# EAGLE schematic BM8L (EAGLE 6.6.0)

## Sheet 1 of 8
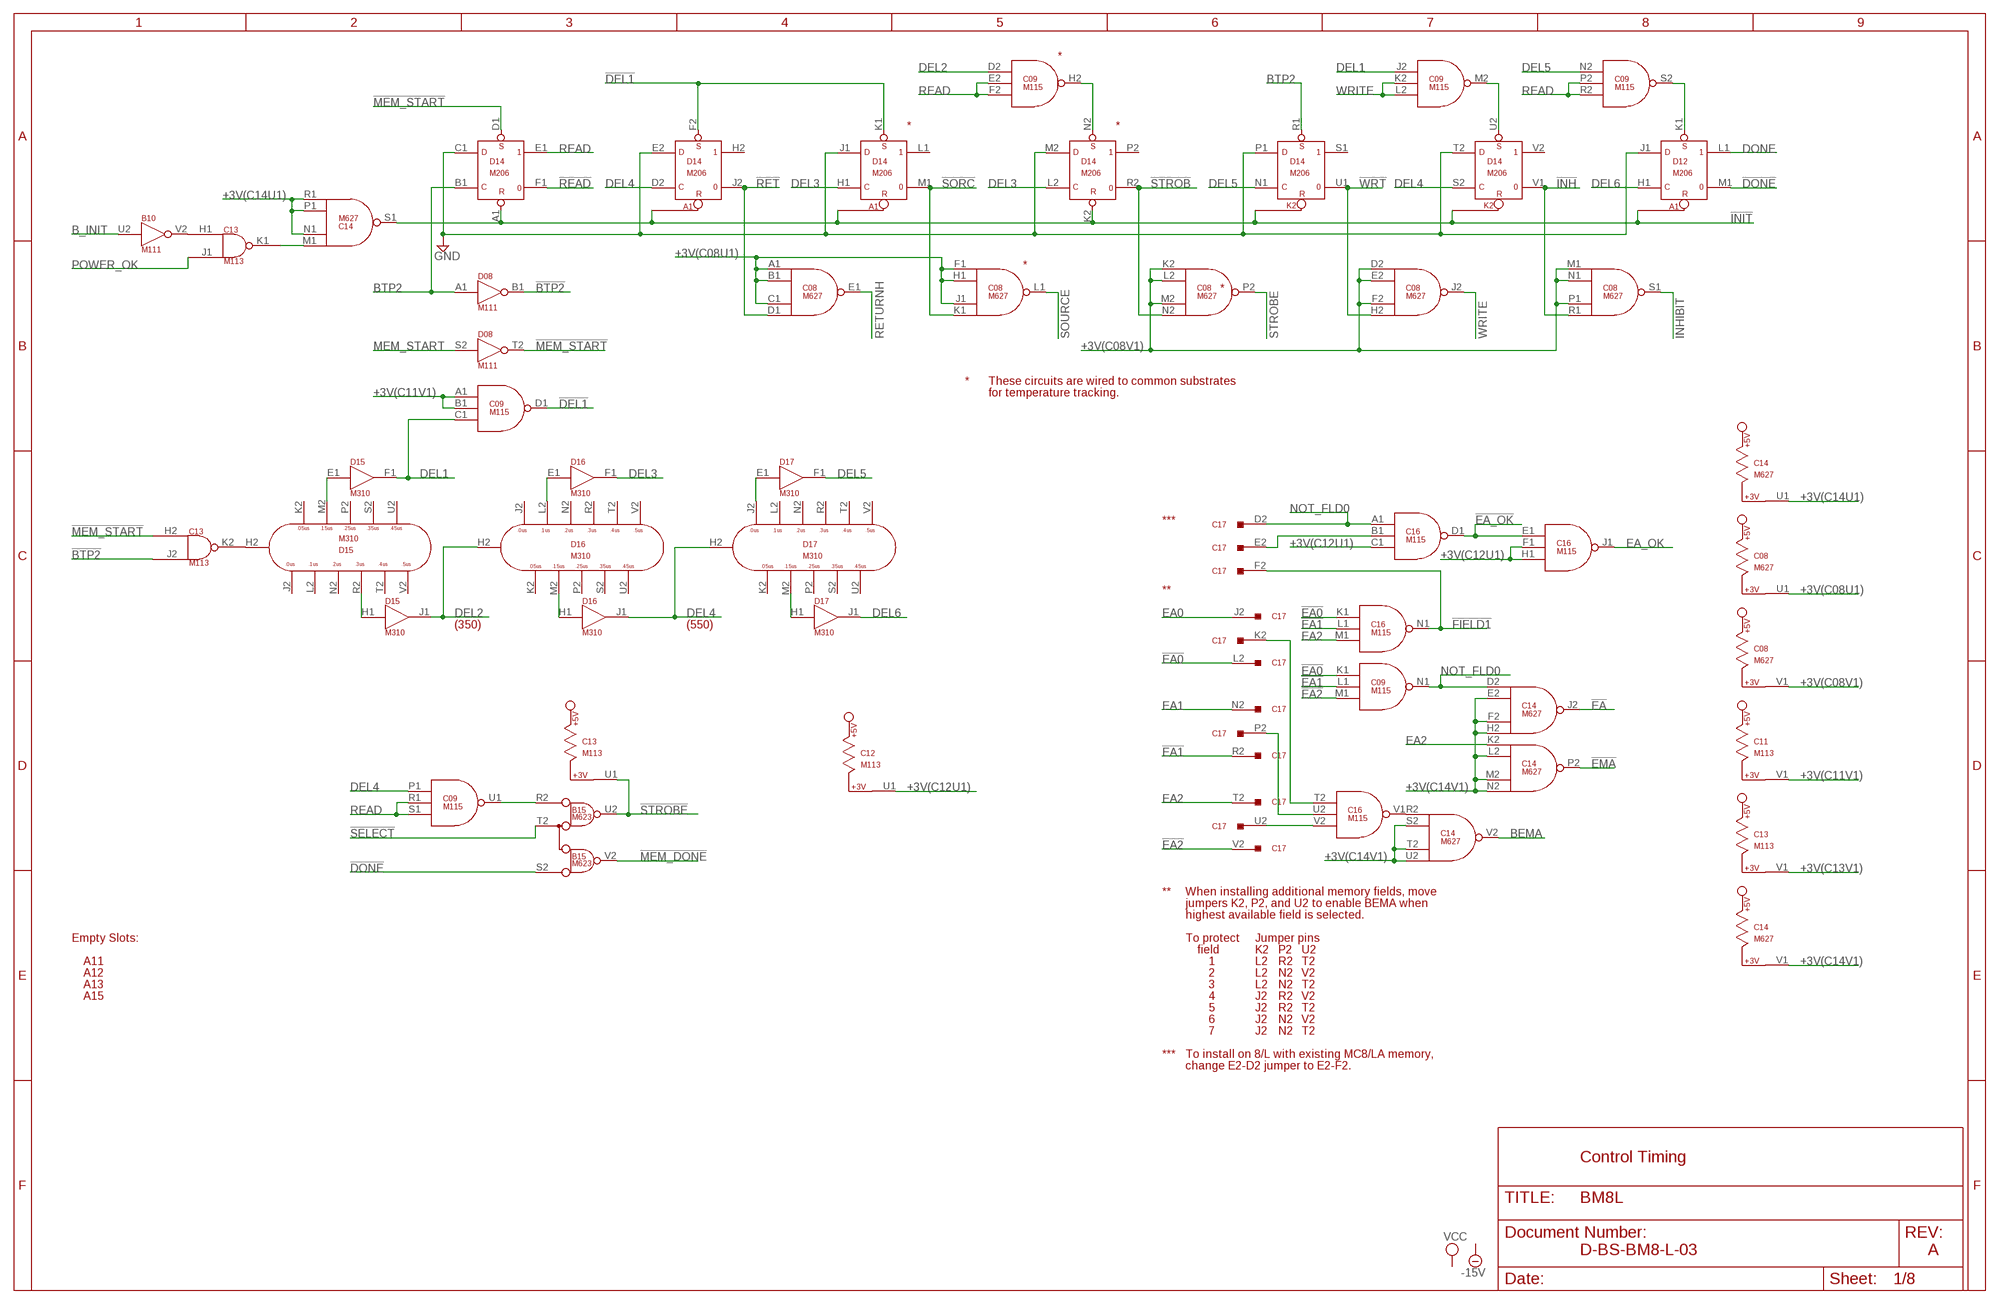
[diagram p0: schematic, sheet 1]

### Parts
A11  EMPTY  [H807]
A12  EMPTY  [H807]
A13  EMPTY  [H807]
A15  EMPTY  [H807]
B10  M111  [H807]
B15  M623  [H807]
C08  M627  [H807]
C09  M115  [H807]
C11  M113  [H807]
C12  M113  [H807]
C13  M113  [H807]
C14  M627  [H807]
C16  M115  [H807]
C17  M990  W023  [H807]
D08  M111  [H807]
D12  M206  M206X  [H807]
D14  M206  M206X  [H807]
D15  M310  [H807]
D16  M310  [H807]
D17  M310  [H807]

### Nets
!BTP2: C13.J2(K2:IN2) D08.B1(B1:OUT)
!DEL1: C09.D1(D1:OUT) D14.F2(H2:S) D14.K1(L1:S)
!DONE: B15.S2(U2:B) D12.M1
!EA: C14.J2(J2:OUT) ; also sheet 7
!EA0: C09.K1(N1:IN1) C16.K1(N1:IN1) C17.L2 ; also sheet 3
!EA1: C09.L1(N1:IN2) C16.L1(N1:IN2) C17.R2 ; also sheet 3
!EA2: C09.M1(N1:IN3) C17.V2 ; also sheet 3
!EA_OK: C16.D1(D1:OUT) C16.E1(J1:IN1)
!EMA: C14.P2(P2:OUT) ; also sheet 7
!FIELD1: C16.N1(N1:OUT) C17.F2 ; also sheet 3
!INH: C08.R1(S1:IN4) D14.V1
!INIT: C14.S1(S1:OUT) D14.A1(E1:R) D14.K2(P2:R) ; also sheet 3
!MEM_DONE: B15.V2(U2:E) ; also sheet 7
!MEM_START: C13.H2(K2:IN1) D08.T2(T2:OUT) D14.D1(E1:S)
!READ: D14.F1 ; also sheet 6
!RET: C08.D1(E1:IN4) D14.J2
!SELECT: B15.T2(U2:C) ; also sheet 3
!SORC: C08.K1(L1:IN4) D14.M1
!STROB: C08.N2(P2:IN4) D14.R2
!STROBE: B15.U2(U2:D) C13.U1 ; also sheet 7
!WRT: C08.H2(J2:IN4) D14.U1
+3V(C08U1): C08.A1(E1:IN1) C08.B1(E1:IN2) C08.C1(E1:IN3) C08.F1(L1:IN1) C08.H1(L1:IN2) C08.J1(L1:IN3) C08.U1 ; also sheet 3
+3V(C08V1): C08.D2(J2:IN1) C08.E2(J2:IN2) C08.F2(J2:IN3) C08.K2(P2:IN1) C08.L2(P2:IN2) C08.M1(S1:IN1) C08.M2(P2:IN3) C08.N1(S1:IN2) C08.P1(S1:IN3) C08.V1
+3V(C11V1): C09.A1(D1:IN1) C09.B1(D1:IN2) C11.V1 ; also sheet 3
+3V(C12U1): C12.U1 C16.C1(D1:IN3) C16.F1(J1:IN2) C16.H1(J1:IN3)
+3V(C13V1): C13.V1 ; also sheet 3
+3V(C14U1): C14.N1(S1:IN2) C14.P1(S1:IN3) C14.R1(S1:IN4) C14.U1 ; also sheet 4
+3V(C14V1): C14.E2(J2:IN2) C14.F2(J2:IN3) C14.H2(J2:IN4) C14.L2(P2:IN2) C14.M2(P2:IN3) C14.N2(P2:IN4) C14.S2(V2:IN2) C14.T2(V2:IN3) C14.U2(V2:IN4) C14.V1
B_INIT: B10.U2(V2:IN) ; also sheet 4,8
BEMA: C14.V2(V2:OUT) ; also sheet 7
BTP2: D08.A1(B1:IN) D14.B1(E1:C) D14.R1(S1:S) ; also sheet 7
DEL1: C09.C1(D1:IN3) C09.J2(M2:IN1) D15.F1(F1:OUT)
DEL2: C09.D2(H2:IN1) D15.J1(J1:OUT) D16.H2(H2:H2) ; also sheet 3
DEL3: D14.H1(L1:C) D14.L2(P2:C) D16.F1(F1:OUT) ; also sheet 3
DEL4: C09.P1(U1:IN1) D14.D2(H2:C) D14.S2(V2:C) D16.J1(J1:OUT) D17.H2(H2:H2) ; also sheet 3
DEL5: C09.N2(S2:IN1) D14.N1(S1:C) D17.F1(F1:OUT)
DEL6: D12.H1(L1:C) D17.J1(J1:OUT)
DONE: D12.L1 ; also sheet 6
EA0: C17.J2 ; also sheet 3,5,6
EA1: C17.N2 ; also sheet 3,5,6
EA2: C14.K2(P2:IN1) C16.M1(N1:IN3) C17.T2 ; also sheet 3
EA_OK: C16.J1(J1:OUT) ; also sheet 3
GND: D12.J1(L1:D) D14.C1(E1:D) D14.E2(H2:D) D14.J1(L1:D) D14.M2(P2:D) D14.P1(S1:D) D14.T2(V2:D) ; also sheet 2,3,5,6
INHIBIT: C08.S1(S1:OUT) ; also sheet 6
MEM_START: D08.S2(T2:IN) ; also sheet 3,7
N$1: B10.V2(V2:OUT) C13.H1(K1:IN1)
N$2: C13.K1(K1:OUT) C14.M1(S1:IN1)
N$3: B15.R2(U2:A) C09.U1(U1:OUT)
N$5: C09.M2(M2:OUT) D14.U2(V2:S)
N$6: C13.K2(K2:OUT) D15.H2(H2:H2)
N$7: D15.H1(J1:IN) D15.R2(H2:R2)
N$8: D15.E1(F1:IN) D15.M2(H2:M2)
N$9: D16.E1(F1:IN) D16.L2(H2:L2)
N$10: D16.H1(J1:IN) D16.M2(H2:M2)
N$11: D17.E1(F1:IN) D17.J2(H2:J2)
N$12: D17.H1(J1:IN) D17.M2(H2:M2)
N$13: C16.V2(V1:IN3) C17.U2
N$14: C16.U2(V1:IN2) C17.P2
N$15: C16.T2(V1:IN1) C17.K2
N$16: C14.R2(V2:IN1) C16.V1(V1:OUT)
N$17: C16.B1(D1:IN2) C17.E2
N$18: C09.H2(H2:OUT) D14.N2(P2:S)
N$19: C09.S2(S2:OUT) D12.K1(L1:S)
NOT_FLD0: C09.N1(N1:OUT) C14.D2(J2:IN1) C16.A1(D1:IN1) C17.D2
POWER_OK: C13.J1(K1:IN2) ; also sheet 7
READ: C09.E2(H2:IN2) C09.F2(H2:IN3) C09.P2(S2:IN2) C09.R1(U1:IN2) C09.R2(S2:IN3) C09.S1(U1:IN3) D14.E1 ; also sheet 3
RETURNH: C08.E1(E1:OUT) ; also sheet 6
SOURCE: C08.L1(L1:OUT) ; also sheet 6
STROBE: C08.P2(P2:OUT) ; also sheet 6
WRITE: C08.J2(J2:OUT) C09.K2(M2:IN2) C09.L2(M2:IN3) ; also sheet 3,4,6
Unconnected: B15.A1(D1:A) B15.B1(D1:B) B15.C1(D1:C) B15.D1(D1:D) B15.D2(H2:A) B15.E1(D1:E) B15.E2(H2:B) B15.F1(K1:A) B15.F2(H2:C) B15.H1(K1:B) B15.H2(H2:D) B15.J1(K1:C) B15.J2(H2:E) B15.K1(K1:D) B15.K2(N2:A) B15.L1(K1:E) B15.L2(N2:B) B15.M1(R1:A) B15.M2(N2:C) B15.N1(R1:B) B15.N2(N2:D) B15.P1(R1:C) B15.P2(N2:E) B15.R1(R1:D) B15.S1(R1:E) C08.R2(V2:IN1) C08.S2(V2:IN2) C08.T2(V2:IN3) C08.U2(V2:IN4) C08.V2(V2:OUT) C11.U1 C12.V1 C16.D2(H2:IN1) C16.E2(H2:IN2) C16.F2(H2:IN3) C16.H2(H2:OUT) C16.J2(M2:IN1) C16.K2(M2:IN2) C16.L2(M2:IN3) C16.M2(M2:OUT) C17.A2 C17.B2 C17.C2 C17.H2 C17.M2 C17.S2 D08.U1(U1:OUT) D08.U2(V2:IN) D08.V1(U1:IN) D08.V2(V2:OUT) D14.H2 D14.L1 D14.P2 D14.S1 D14.V2 D15.J2(H2:J2) D15.K2(H2:K2) D15.L2(H2:L2) D15.N2(H2:N2) D15.P2(H2:P2) D15.S2(H2:S2) D15.T2(H2:T2) D15.U2(H2:U2) D15.V2(H2:V2) D16.J2(H2:J2) D16.K2(H2:K2) D16.N2(H2:N2) D16.P2(H2:P2) D16.R2(H2:R2) D16.S2(H2:S2) D16.T2(H2:T2) D16.U2(H2:U2) D16.V2(H2:V2) D17.K2(H2:K2) D17.L2(H2:L2) D17.N2(H2:N2) D17.P2(H2:P2) D17.R2(H2:R2) D17.S2(H2:S2) D17.T2(H2:T2) D17.U2(H2:U2) D17.V2(H2:V2)

### Notes on the sheet
- *
- * | *
- *
- *
- * | These circuits are wired to common substrates
- for temperature tracking.
- ***
- **
- (350) | (550)
- ** | When installing additional memory fields, move
- jumpers K2, P2, and U2 to enable BEMA when
- highest available field is selected.
- Empty Slots: | To protect | Jumper pins
- field | K2 | P2 | U2
- 1 | L2 | R2 | T2
- 2 | L2 | N2 | V2
- 3 | L2 | N2 | T2
- 4 | J2 | R2 | V2
- 5 | J2 | R2 | T2
- 6 | J2 | N2 | V2
- 7 | J2 | N2 | T2
- *** | To install on 8/L with existing MC8/LA memory,
- change E2-D2 jumper to E2-F2.
- Control Timing
- D-BS-BM8-L-03 | A

## Sheet 2 of 8
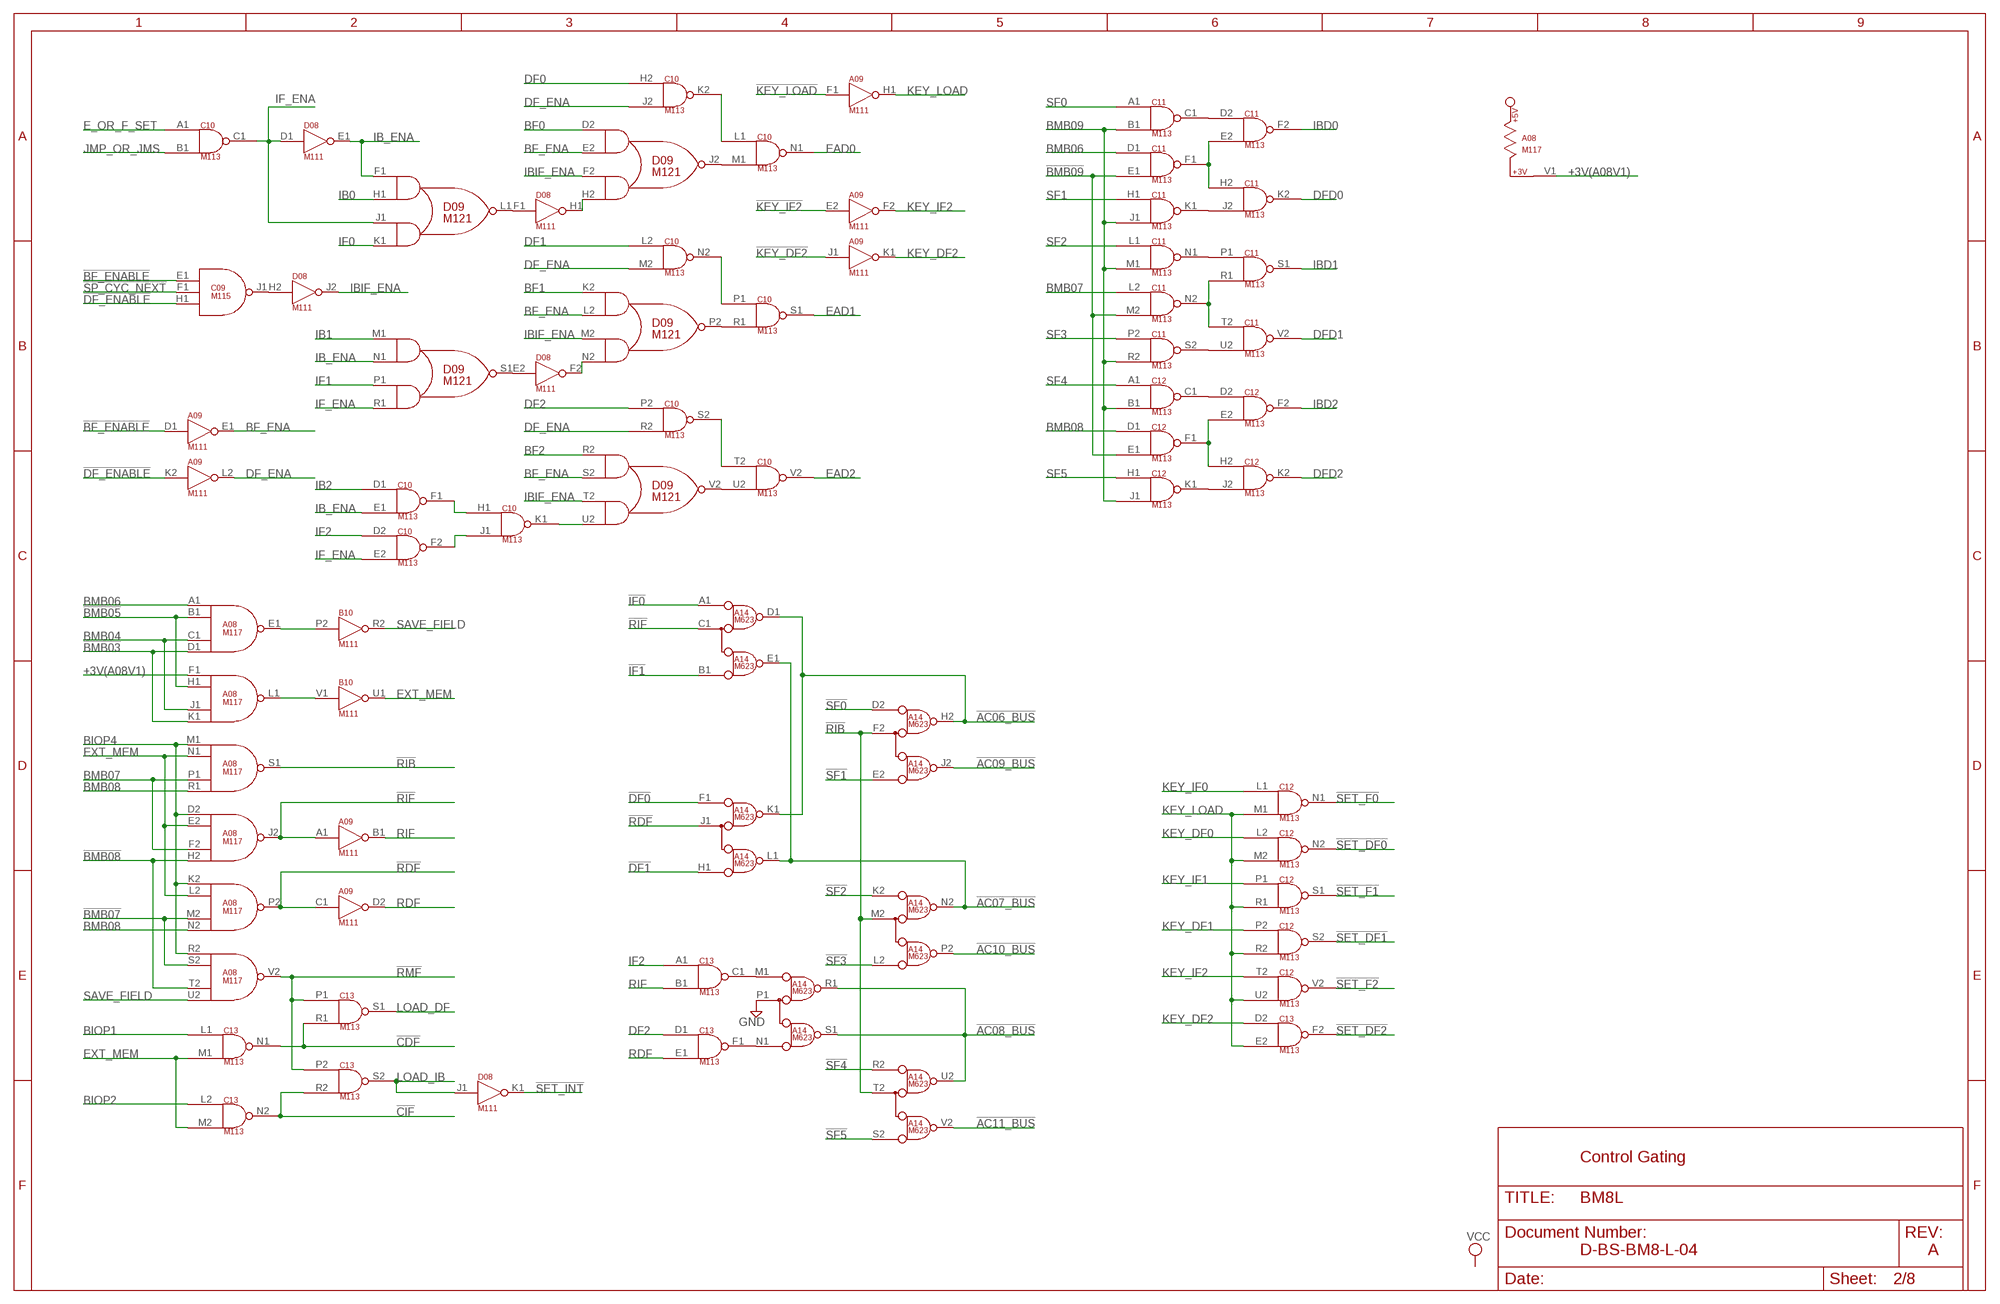
[diagram p1: schematic, sheet 2]

### Parts
A08  M117  [H807]
A09  M111  [H807]
A14  M623  [H807]
C10  M113  [H807]
D09  M121  [H807]

### Nets
!AC06_BUS: A14.D1(D1:D) A14.H2(H2:D) A14.K1(K1:D) ; also sheet 8
!AC07_BUS: A14.E1(D1:E) A14.L1(K1:E) A14.N2(N2:D) ; also sheet 8
!AC08_BUS: A14.R1(R1:D) A14.S1(R1:E) A14.U2(U2:D) ; also sheet 8
!AC09_BUS: A14.J2(H2:E) ; also sheet 8
!AC10_BUS: A14.P2(N2:E) ; also sheet 8
!AC11_BUS: A14.V2(U2:E) ; also sheet 8
!BF_ENABLE: A09.D1(E1:IN) C09.E1(J1:IN1) ; also sheet 7
!BMB03: A08.D1(E1:IN4) A08.K1(L1:IN4) ; also sheet 4,5,8
!BMB05: A08.B1(E1:IN2) A08.H1(L1:IN2) ; also sheet 4,5,8
!BMB07: A08.M2(P2:IN3) A08.S2(V2:IN2) ; also sheet 4,5,8
!BMB08: A08.H2(J2:IN4) A08.T2(V2:IN3) ; also sheet 4,5,8
!BMB09: C11.E1(F1:IN2) C11.M2(N2:IN2) C12.E1(F1:IN2) ; also sheet 4,5
!CDF: C13.N1(N1:OUT) C13.R1(S1:IN2)
!CIF: C13.N2(N2:OUT) C13.R2(S2:IN2)
!DF0: A14.F1(K1:A) ; also sheet 3
!DF1: A14.H1(K1:B) ; also sheet 3
!DF_ENABLE: A09.K2(L2:IN) C09.H1(J1:IN3) ; also sheet 7
!IF0: A14.A1(D1:A) ; also sheet 3
!IF1: A14.B1(D1:B) ; also sheet 3
!KEY_DF2: A09.J1(K1:IN) ; also sheet 7
!KEY_IF2: A09.E2(F2:IN) ; also sheet 7
!KEY_LOAD: A09.F1(H1:IN) ; also sheet 7
!RDF: A08.P2(P2:OUT) A09.C1(D2:IN) A14.J1(K1:C)
!RIB: A08.S1(S1:OUT) A14.F2(H2:C) A14.M2(N2:C) A14.T2(U2:C)
!RIF: A08.J2(J2:OUT) A09.A1(B1:IN) A14.C1(D1:C)
!RMF: A08.V2(V2:OUT) C13.P1(S1:IN1) C13.P2(S2:IN1)
!SET_DF0: C12.N2(N2:OUT) ; also sheet 3
!SET_DF1: C12.S2(S2:OUT) ; also sheet 3
!SET_DF2: C13.F2(F2:OUT) ; also sheet 3
!SET_F0: C12.N1(N1:OUT) ; also sheet 3
!SET_F1: C12.S1(S1:OUT) ; also sheet 3
!SET_F2: C12.V2(V2:OUT) ; also sheet 3
!SET_INT: D08.K1(K1:OUT) ; also sheet 3
!SF0: A14.D2(H2:A) ; also sheet 3
!SF1: A14.E2(H2:B) ; also sheet 3
!SF2: A14.K2(N2:A) ; also sheet 3
!SF3: A14.L2(N2:B) ; also sheet 3
!SF4: A14.R2(U2:A) ; also sheet 3
!SF5: A14.S2(U2:B) ; also sheet 3
!SP_CYC_NEXT: C09.F1(J1:IN2) ; also sheet 7
+3V(A08V1): A08.F1(L1:IN1) A08.V1 ; also sheet 4
BF0: D09.D2(J2:IN1A) ; also sheet 3
BF1: D09.K2(P2:IN1A) ; also sheet 3
BF2: D09.R2(V2:IN1A) ; also sheet 3
BF_ENA: A09.E1(E1:OUT) D09.E2(J2:IN1B) D09.L2(P2:IN1B) D09.S2(V2:IN1B)
BIOP1: C13.L1(N1:IN1) ; also sheet 8
BIOP2: C13.L2(N2:IN1) ; also sheet 8
BIOP4: A08.D2(J2:IN1) A08.K2(P2:IN1) A08.M1(S1:IN1) A08.R2(V2:IN1) ; also sheet 8
BMB04: A08.C1(E1:IN3) A08.J1(L1:IN3) ; also sheet 5,8
BMB06: A08.A1(E1:IN1) C11.D1(F1:IN1) ; also sheet 5,8
BMB07: A08.F2(J2:IN3) A08.P1(S1:IN3) C11.L2(N2:IN1) ; also sheet 5,8
BMB08: A08.N2(P2:IN4) A08.R1(S1:IN4) C12.D1(F1:IN1) ; also sheet 5,8
BMB09: C11.B1(C1:IN2) C11.J1(K1:IN2) C11.M1(N1:IN2) C11.R2(S2:IN2) C12.B1(C1:IN2) C12.J1(K1:IN2) ; also sheet 5,8
DF0: C10.H2(K2:IN1) ; also sheet 3
DF1: C10.L2(N2:IN1) ; also sheet 3
DF2: C10.P2(S2:IN1) C13.D1(F1:IN1) ; also sheet 3
DF_ENA: A09.L2(L2:OUT) C10.J2(K2:IN2) C10.M2(N2:IN2) C10.R2(S2:IN2)
DFD0: C11.K2(K2:OUT) ; also sheet 3
DFD1: C11.V2(V2:OUT) ; also sheet 3
DFD2: C12.K2(K2:OUT) ; also sheet 3
E_OR_F_SET: C10.A1(C1:IN1) ; also sheet 3,7
EAD0: C10.N1(N1:OUT) ; also sheet 3
EAD1: C10.S1(S1:OUT) ; also sheet 3
EAD2: C10.V2(V2:OUT) ; also sheet 3
EXT_MEM: A08.E2(J2:IN2) A08.L2(P2:IN2) A08.N1(S1:IN2) B10.U1(U1:OUT) C13.M1(N1:IN2) C13.M2(N2:IN2)
GND: A14.P1(R1:C) ; also sheet 1,3,5,6
IB0: D09.H1(L1:IN1B) ; also sheet 3
IB1: D09.M1(S1:IN1A) ; also sheet 3
IB2: C10.D1(F1:IN1) ; also sheet 3
IB_ENA: C10.E1(F1:IN2) D08.E1(E1:OUT) D09.F1(L1:IN1A) D09.N1(S1:IN1B)
IBD0: C11.F2(F2:OUT) ; also sheet 3
IBD1: C11.S1(S1:OUT) ; also sheet 3
IBD2: C12.F2(F2:OUT) ; also sheet 3
IBIF_ENA: D08.J2(J2:OUT) D09.F2(J2:IN2A) D09.M2(P2:IN2A) D09.T2(V2:IN2A)
IF0: D09.K1(L1:IN2B) ; also sheet 3
IF1: D09.P1(S1:IN2A) ; also sheet 3
IF2: C10.D2(F2:IN1) C13.A1(C1:IN1) ; also sheet 3
IF_ENA: C10.C1(C1:OUT) C10.E2(F2:IN2) D08.D1(E1:IN) D09.J1(L1:IN2A) D09.R1(S1:IN2B)
JMP_OR_JMS: C10.B1(C1:IN2) ; also sheet 3,7
KEY_DF0: C12.L2(N2:IN1) ; also sheet 5,6
KEY_DF1: C12.P2(S2:IN1) ; also sheet 5,6
KEY_DF2: A09.K1(K1:OUT) C13.D2(F2:IN1)
KEY_IF0: C12.L1(N1:IN1) ; also sheet 5,6
KEY_IF1: C12.P1(S1:IN1) ; also sheet 5,6
KEY_IF2: A09.F2(F2:OUT) C12.T2(V2:IN1)
KEY_LOAD: A09.H1(H1:OUT) C12.M1(N1:IN2) C12.M2(N2:IN2) C12.R1(S1:IN2) C12.R2(S2:IN2) C12.U2(V2:IN2) C13.E2(F2:IN2)
LOAD_DF: C13.S1(S1:OUT) ; also sheet 3
LOAD_IB: C13.S2(S2:OUT) D08.J1(K1:IN) ; also sheet 3
N$4: D08.F1(H1:IN) D09.L1(L1:OUT)
N$20: D08.H1(H1:OUT) D09.H2(J2:IN2B)
N$21: C10.K2(K2:OUT) C10.L1(N1:IN1)
N$22: C10.M1(N1:IN2) D09.J2(J2:OUT)
N$23: D08.E2(F2:IN) D09.S1(S1:OUT)
N$24: D08.F2(F2:OUT) D09.N2(P2:IN2B)
N$25: C10.R1(S1:IN2) D09.P2(P2:OUT)
N$26: C10.N2(N2:OUT) C10.P1(S1:IN1)
N$27: C10.K1(K1:OUT) D09.U2(V2:IN2B)
N$28: C10.F1(F1:OUT) C10.H1(K1:IN1)
N$29: C10.F2(F2:OUT) C10.J1(K1:IN2)
N$30: C09.J1(J1:OUT) D08.H2(J2:IN)
N$31: C11.E2(F2:IN2) C11.F1(F1:OUT) C11.H2(K2:IN1)
N$32: C11.N1(N1:OUT) C11.P1(S1:IN1)
N$33: C10.U2(V2:IN2) D09.V2(V2:OUT)
N$34: C10.S2(S2:OUT) C10.T2(V2:IN1)
N$35: C11.J2(K2:IN2) C11.K1(K1:OUT)
N$36: C11.C1(C1:OUT) C11.D2(F2:IN1)
N$37: C11.S2(S2:OUT) C11.U2(V2:IN2)
N$38: C11.N2(N2:OUT) C11.R1(S1:IN2) C11.T2(V2:IN1)
N$39: C12.E2(F2:IN2) C12.F1(F1:OUT) C12.H2(K2:IN1)
N$40: C12.C1(C1:OUT) C12.D2(F2:IN1)
N$41: C12.J2(K2:IN2) C12.K1(K1:OUT)
N$42: A14.M1(R1:A) C13.C1(C1:OUT)
N$43: A08.E1(E1:OUT) B10.P2(R2:IN)
N$44: A08.L1(L1:OUT) B10.V1(U1:IN)
N$45: A14.N1(R1:B) C13.F1(F1:OUT)
RDF: A09.D2(D2:OUT) C13.E1(F1:IN2)
RIF: A09.B1(B1:OUT) C13.B1(C1:IN2)
SAVE_FIELD: A08.U2(V2:IN4) B10.R2(R2:OUT)
SF0: C11.A1(C1:IN1) ; also sheet 3
SF1: C11.H1(K1:IN1) ; also sheet 3
SF2: C11.L1(N1:IN1) ; also sheet 3
SF3: C11.P2(S2:IN1) ; also sheet 3
SF4: C12.A1(C1:IN1) ; also sheet 3
SF5: C12.H1(K1:IN1) ; also sheet 3
Unconnected: A08.U1 A09.H2(J2:IN) A09.J2(J2:OUT) A09.L1(M1:IN) A09.M1(M1:OUT) A09.M2(N2:IN) A09.N1(P1:IN) A09.N2(N2:OUT) A09.P1(P1:OUT) A09.P2(R2:IN) A09.R1(S1:IN) A09.R2(R2:OUT) A09.S1(S1:OUT) A09.S2(T2:IN) A09.T2(T2:OUT) A09.U1(U1:OUT) A09.U2(V2:IN) A09.V1(U1:IN) A09.V2(V2:OUT) C10.U1 C10.V1 D09.A1(E1:IN1A) D09.B1(E1:IN1B) D09.C1(E1:IN2A) D09.D1(E1:IN2B) D09.E1(E1:OUT) D09.U1 D09.V1

### Notes on the sheet
- Control Gating
- D-BS-BM8-L-04 | A

## Sheet 3 of 8
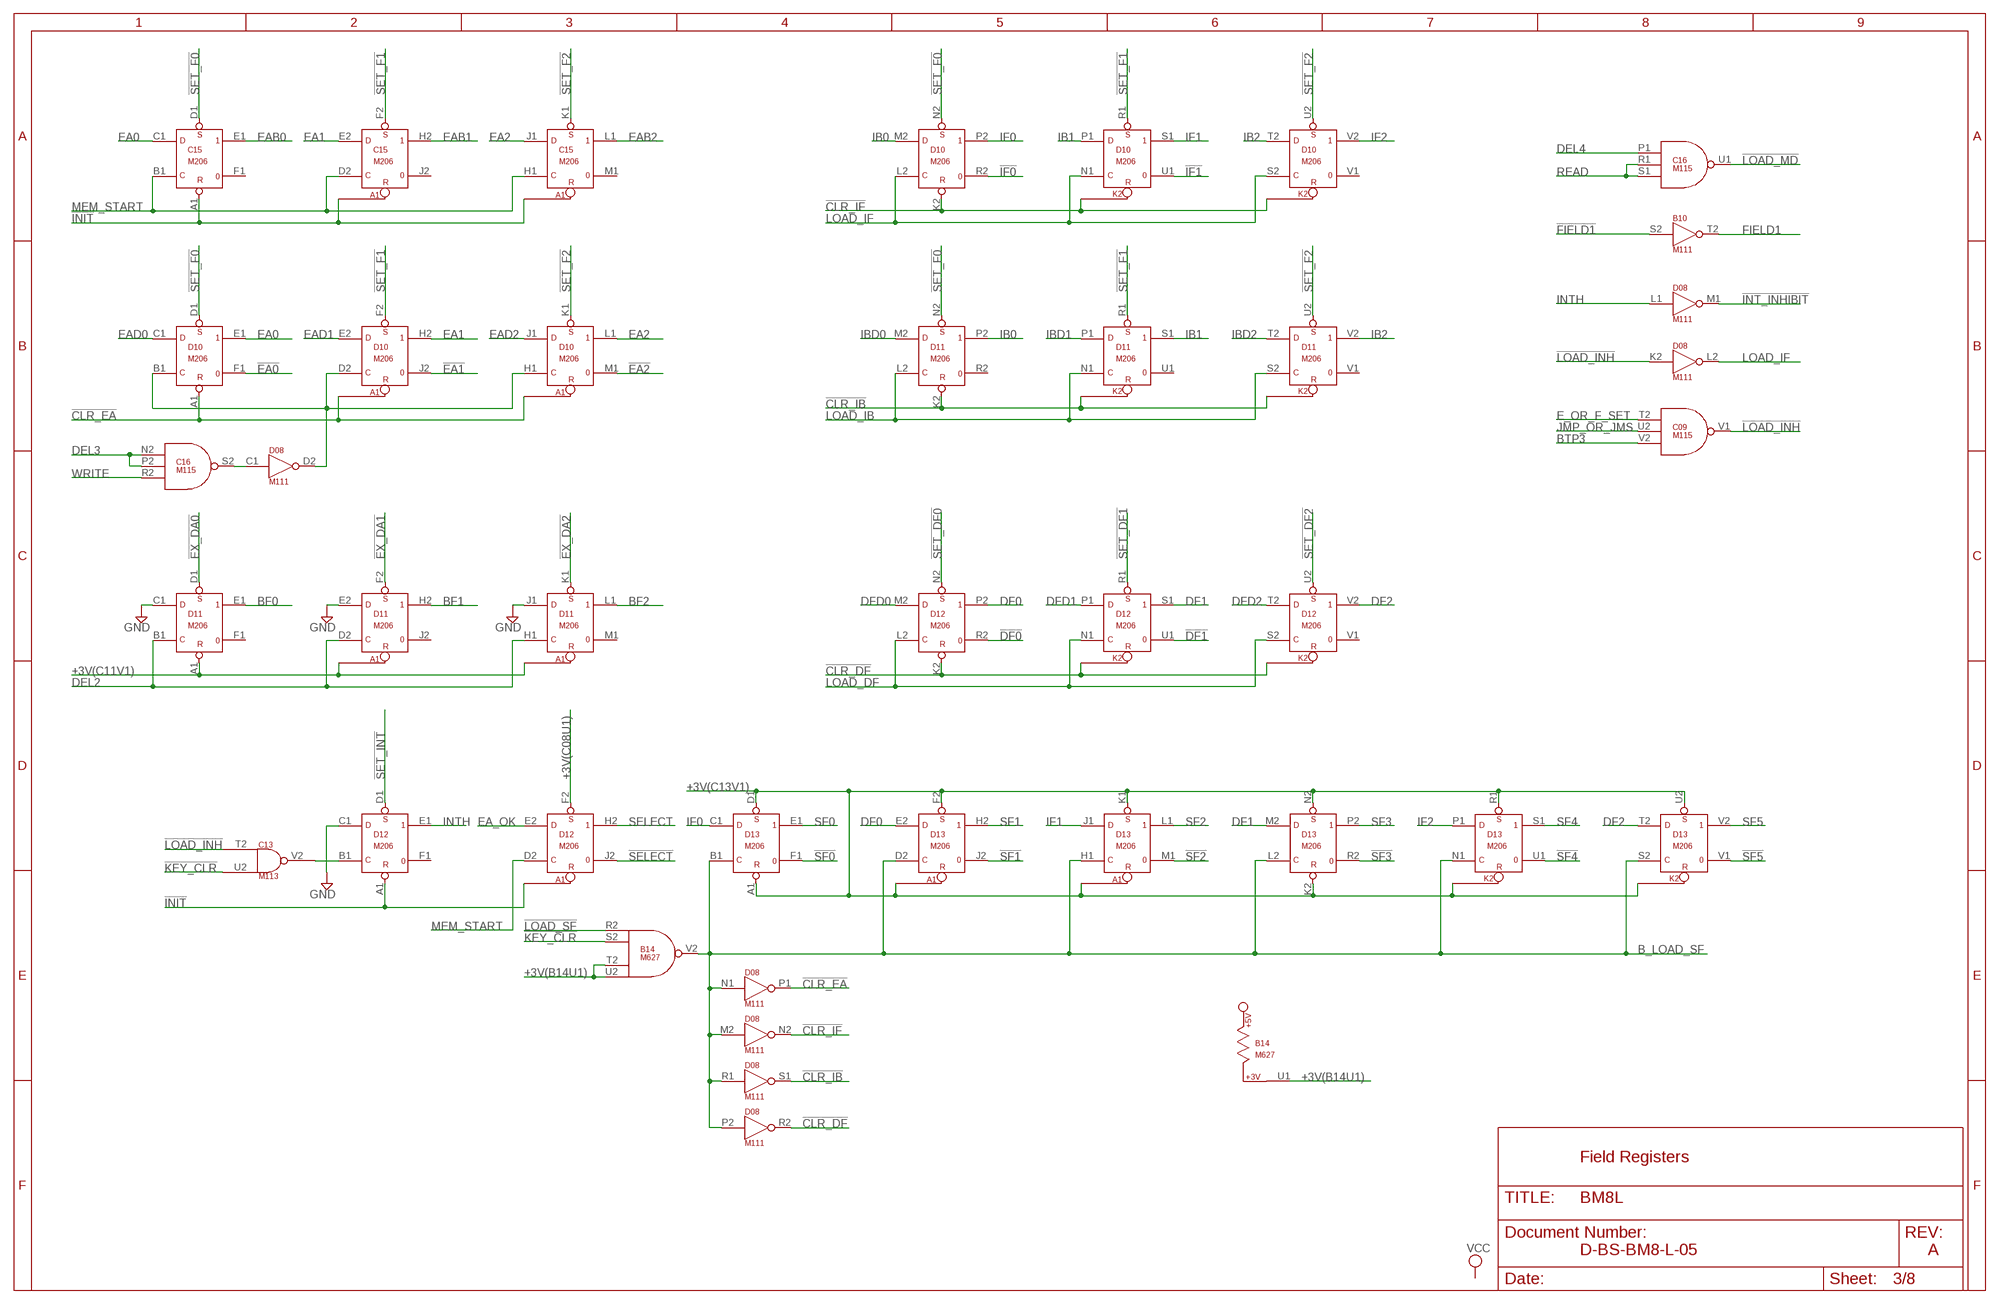
[diagram p2: schematic, sheet 3]

### Parts
B14  M627  [H807]
C15  M206  M206X  [H807]
D10  M206  M206X  [H807]
D11  M206  M206X  [H807]
D13  M206  M206X  [H807]

### Nets
!CLR_DF: D08.R2(R2:OUT) D12.K2(P2:R)
!CLR_EA: D08.P1(P1:OUT) D10.A1(E1:R)
!CLR_IB: D08.S1(S1:OUT) D11.K2(P2:R)
!CLR_IF: D08.N2(N2:OUT) D10.K2(P2:R)
!DF0: D12.R2 ; also sheet 2
!DF1: D12.U1 ; also sheet 2
!EA0: D10.F1 ; also sheet 1
!EA1: D10.J2 ; also sheet 1
!EA2: D10.M1 ; also sheet 1
!EX_DA0: D11.D1(E1:S) ; also sheet 8
!EX_DA1: D11.F2(H2:S) ; also sheet 8
!EX_DA2: D11.K1(L1:S) ; also sheet 8
!FIELD1: B10.S2(T2:IN) ; also sheet 1
!IF0: D10.R2 ; also sheet 2
!IF1: D10.U1 ; also sheet 2
!INIT: C15.A1(E1:R) D12.A1(E1:R) ; also sheet 1
!INT_INHIBIT: D08.M1(M1:OUT) ; also sheet 7
!KEY_CLR: B14.S2(V2:IN2) C13.U2(V2:IN2) ; also sheet 7
!LOAD_INH: C09.V1(V1:OUT) C13.T2(V2:IN1) D08.K2(L2:IN)
!LOAD_MD: C16.U1(U1:OUT) ; also sheet 4
!LOAD_SF: B14.R2(V2:IN1) ; also sheet 7
!SELECT: D12.J2 ; also sheet 1
!SET_DF0: D12.N2(P2:S) ; also sheet 2
!SET_DF1: D12.R1(S1:S) ; also sheet 2
!SET_DF2: D12.U2(V2:S) ; also sheet 2
!SET_F0: C15.D1(E1:S) D10.D1(E1:S) D10.N2(P2:S) D11.N2(P2:S) ; also sheet 2
!SET_F1: C15.F2(H2:S) D10.F2(H2:S) D10.R1(S1:S) D11.R1(S1:S) ; also sheet 2
!SET_F2: C15.K1(L1:S) D10.K1(L1:S) D10.U2(V2:S) D11.U2(V2:S) ; also sheet 2
!SET_INT: D12.D1(E1:S) ; also sheet 2
!SF0: D13.F1 ; also sheet 2
!SF1: D13.J2 ; also sheet 2
!SF2: D13.M1 ; also sheet 2
!SF3: D13.R2 ; also sheet 2
!SF4: D13.U1 ; also sheet 2
!SF5: D13.V1 ; also sheet 2
+3V(B14U1): B14.T2(V2:IN3) B14.U1 B14.U2(V2:IN4) ; also sheet 4
+3V(C08U1): D12.F2(H2:S) ; also sheet 1
+3V(C11V1): D11.A1(E1:R) ; also sheet 1
+3V(C13V1): D13.A1(E1:R) D13.D1(E1:S) D13.F2(H2:S) D13.K1(L1:S) D13.K2(P2:R) D13.N2(P2:S) D13.R1(S1:S) D13.U2(V2:S) ; also sheet 1
B_LOAD_SF: B14.V2(V2:OUT) D08.M2(N2:IN) D08.N1(P1:IN) D08.P2(R2:IN) D08.R1(S1:IN) D13.B1(E1:C) D13.D2(H2:C) D13.H1(L1:C) D13.L2(P2:C) D13.N1(S1:C) D13.S2(V2:C)
BF0: D11.E1 ; also sheet 2
BF1: D11.H2 ; also sheet 2
BF2: D11.L1 ; also sheet 2
BTP3: C09.V2(V1:IN3) ; also sheet 7
DEL2: D11.B1(E1:C) D11.D2(H2:C) D11.H1(L1:C) ; also sheet 1
DEL3: C16.N2(S2:IN1) C16.P2(S2:IN2) ; also sheet 1
DEL3WRT: D08.D2(D2:OUT) D10.B1(E1:C) D10.D2(H2:C) D10.H1(L1:C)
DEL4: C16.P1(U1:IN1) ; also sheet 1
DF0: D12.P2 D13.E2(H2:D) ; also sheet 2
DF1: D12.S1 D13.M2(P2:D) ; also sheet 2
DF2: D12.V2 D13.T2(V2:D) ; also sheet 2
DFD0: D12.M2(P2:D) ; also sheet 2
DFD1: D12.P1(S1:D) ; also sheet 2
DFD2: D12.T2(V2:D) ; also sheet 2
E_OR_F_SET: C09.T2(V1:IN1) ; also sheet 2,7
EA0: C15.C1(E1:D) D10.E1 ; also sheet 1,5,6
EA1: C15.E2(H2:D) D10.H2 ; also sheet 1,5,6
EA2: C15.J1(L1:D) D10.L1 ; also sheet 1
EA_OK: D12.E2(H2:D) ; also sheet 1
EAB0: C15.E1 ; also sheet 5
EAB1: C15.H2 ; also sheet 5
EAB2: C15.L1 ; also sheet 5
EAD0: D10.C1(E1:D) ; also sheet 2
EAD1: D10.E2(H2:D) ; also sheet 2
EAD2: D10.J1(L1:D) ; also sheet 2
FIELD1: B10.T2(T2:OUT) ; also sheet 7
GND: D11.C1(E1:D) D11.E2(H2:D) D11.J1(L1:D) D12.C1(E1:D) ; also sheet 1,2,5,6
IB0: D10.M2(P2:D) D11.P2 ; also sheet 2
IB1: D10.P1(S1:D) D11.S1 ; also sheet 2
IB2: D10.T2(V2:D) D11.V2 ; also sheet 2
IBD0: D11.M2(P2:D) ; also sheet 2
IBD1: D11.P1(S1:D) ; also sheet 2
IBD2: D11.T2(V2:D) ; also sheet 2
IF0: D10.P2 D13.C1(E1:D) ; also sheet 2
IF1: D10.S1 D13.J1(L1:D) ; also sheet 2
IF2: D10.V2 D13.P1(S1:D) ; also sheet 2
INTH: D08.L1(M1:IN) D12.E1
JMP_OR_JMS: C09.U2(V1:IN2) ; also sheet 2,7
LOAD_DF: D12.L2(P2:C) D12.N1(S1:C) D12.S2(V2:C) ; also sheet 2
LOAD_IB: D11.L2(P2:C) D11.N1(S1:C) D11.S2(V2:C) ; also sheet 2
LOAD_IF: D08.L2(L2:OUT) D10.L2(P2:C) D10.N1(S1:C) D10.S2(V2:C)
MEM_START: C15.B1(E1:C) C15.D2(H2:C) C15.H1(L1:C) D12.D2(H2:C) ; also sheet 1,7
N$46: C16.S2(S2:OUT) D08.C1(D2:IN)
N$47: C13.V2(V2:OUT) D12.B1(E1:C)
READ: C16.R1(U1:IN2) C16.S1(U1:IN3) ; also sheet 1
SELECT: D12.H2 ; also sheet 4
SF0: D13.E1 ; also sheet 2
SF1: D13.H2 ; also sheet 2
SF2: D13.L1 ; also sheet 2
SF3: D13.P2 ; also sheet 2
SF4: D13.S1 ; also sheet 2
SF5: D13.V2 ; also sheet 2
WRITE: C16.R2(S2:IN3) ; also sheet 1,4,6
Unconnected: C15.F1 C15.J2 C15.K2(P2:R) C15.L2(P2:C) C15.M1 C15.M2(P2:D) C15.N1(S1:C) C15.N2(P2:S) C15.P1(S1:D) C15.P2 C15.R1(S1:S) C15.R2 C15.S1 C15.S2(V2:C) C15.T2(V2:D) C15.U1 C15.U2(V2:S) C15.V1 C15.V2 D10.V1 D11.F1 D11.J2 D11.M1 D11.R2 D11.U1 D11.V1 D12.F1 D12.V1

### Notes on the sheet
- Field Registers
- D-BS-BM8-L-05 | A

## Sheet 4 of 8
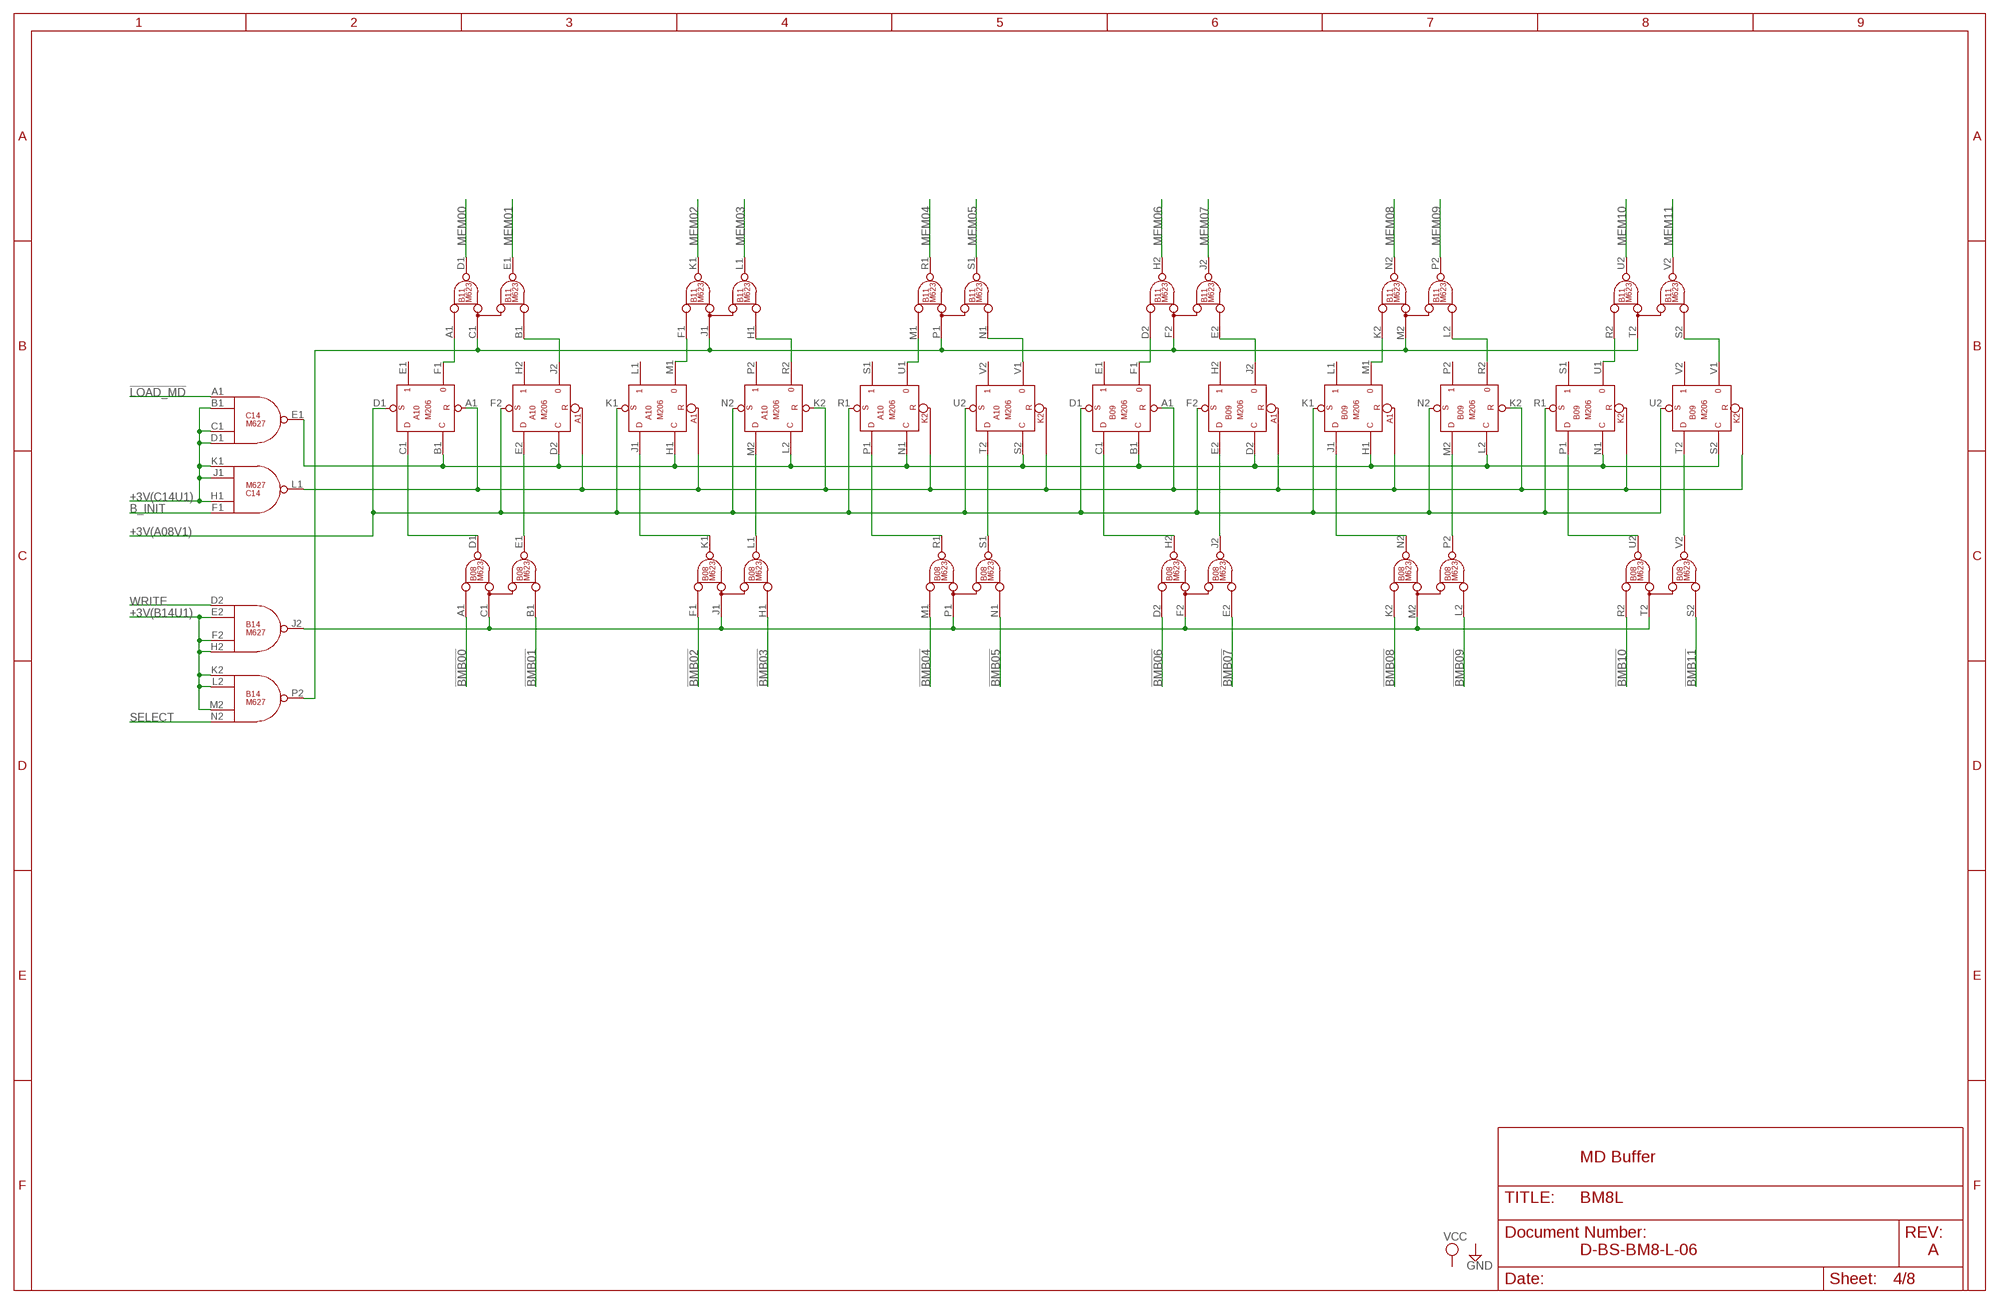
[diagram p3: schematic, sheet 4]

### Parts
A10  M206  M206X  [H807]
B08  M623  [H807]
B09  M206  M206X  [H807]
B11  M623  [H807]

### Nets
!BMB00: B08.A1(D1:A) ; also sheet 5
!BMB01: B08.B1(D1:B) ; also sheet 5
!BMB02: B08.F1(K1:A) ; also sheet 5
!BMB03: B08.H1(K1:B) ; also sheet 2,5,8
!BMB04: B08.M1(R1:A) ; also sheet 5,8
!BMB05: B08.N1(R1:B) ; also sheet 2,5,8
!BMB06: B08.D2(H2:A) ; also sheet 5,8
!BMB07: B08.E2(H2:B) ; also sheet 2,5,8
!BMB08: B08.K2(N2:A) ; also sheet 2,5,8
!BMB09: B08.L2(N2:B) ; also sheet 2,5
!BMB10: B08.R2(U2:A) ; also sheet 5
!BMB11: B08.S2(U2:B) ; also sheet 5
!LOAD_MD: C14.A1(E1:IN1) ; also sheet 3
+3V(A08V1): A10.D1(E1:S) A10.F2(H2:S) A10.K1(L1:S) A10.N2(P2:S) A10.R1(S1:S) A10.U2(V2:S) B09.D1(E1:S) B09.F2(H2:S) B09.K1(L1:S) B09.N2(P2:S) B09.R1(S1:S) B09.U2(V2:S) ; also sheet 2
+3V(B14U1): B14.E2(J2:IN2) B14.F2(J2:IN3) B14.H2(J2:IN4) B14.K2(P2:IN1) B14.L2(P2:IN2) B14.M2(P2:IN3) ; also sheet 3
+3V(C14U1): C14.B1(E1:IN2) C14.C1(E1:IN3) C14.D1(E1:IN4) C14.H1(L1:IN2) C14.J1(L1:IN3) C14.K1(L1:IN4) ; also sheet 1
B_INIT: C14.F1(L1:IN1) ; also sheet 1,8
MEM00: B11.D1(D1:D) ; also sheet 7
MEM01: B11.E1(D1:E) ; also sheet 7
MEM02: B11.K1(K1:D) ; also sheet 7
MEM03: B11.L1(K1:E) ; also sheet 7
MEM04: B11.R1(R1:D) ; also sheet 7
MEM05: B11.S1(R1:E) ; also sheet 7
MEM06: B11.H2(H2:D) ; also sheet 7
MEM07: B11.J2(H2:E) ; also sheet 7
MEM08: B11.N2(N2:D) ; also sheet 7
MEM09: B11.P2(N2:E) ; also sheet 7
MEM10: B11.U2(U2:D) ; also sheet 7
MEM11: B11.V2(U2:E) ; also sheet 7
N$48: B11.C1(D1:C) B11.F2(H2:C) B11.J1(K1:C) B11.M2(N2:C) B11.P1(R1:C) B11.T2(U2:C) B14.P2(P2:OUT)
N$49: A10.B1(E1:C) A10.D2(H2:C) A10.H1(L1:C) A10.L2(P2:C) A10.N1(S1:C) A10.S2(V2:C) B09.B1(E1:C) B09.D2(H2:C) B09.H1(L1:C) B09.L2(P2:C) B09.N1(S1:C) B09.S2(V2:C) C14.E1(E1:OUT)
N$50: B08.C1(D1:C) B08.F2(H2:C) B08.J1(K1:C) B08.M2(N2:C) B08.P1(R1:C) B08.T2(U2:C) B14.J2(J2:OUT)
N$51: A10.A1(E1:R) A10.K2(P2:R) B09.A1(E1:R) B09.K2(P2:R) C14.L1(L1:OUT)
N$52: A10.C1(E1:D) B08.D1(D1:D)
N$55: A10.E2(H2:D) B08.E1(D1:E)
N$56: A10.J1(L1:D) B08.K1(K1:D)
N$57: A10.M2(P2:D) B08.L1(K1:E)
N$58: A10.T2(V2:D) B08.S1(R1:E)
N$59: B08.J2(H2:E) B09.E2(H2:D)
N$60: B08.H2(H2:D) B09.C1(E1:D)
N$61: A10.P1(S1:D) B08.R1(R1:D)
N$62: B08.N2(N2:D) B09.J1(L1:D)
N$63: B08.P2(N2:E) B09.M2(P2:D)
N$64: B08.U2(U2:D) B09.P1(S1:D)
N$65: B08.V2(U2:E) B09.T2(V2:D)
N$66: A10.U1 B11.M1(R1:A)
N$67: A10.V1 B11.N1(R1:B)
N$68: A10.F1 B11.A1(D1:A)
N$69: A10.J2 B11.B1(D1:B)
N$70: A10.M1 B11.F1(K1:A)
N$71: A10.R2 B11.H1(K1:B)
N$72: B09.F1 B11.D2(H2:A)
N$73: B09.J2 B11.E2(H2:B)
N$74: B09.M1 B11.K2(N2:A)
N$75: B09.R2 B11.L2(N2:B)
N$76: B09.U1 B11.R2(U2:A)
N$77: B09.V1 B11.S2(U2:B)
SELECT: B14.N2(P2:IN4) ; also sheet 3
WRITE: B14.D2(J2:IN1) ; also sheet 1,3,6
Unconnected: A10.E1 A10.H2 A10.L1 A10.P2 A10.S1 A10.V2 B09.E1 B09.H2 B09.L1 B09.P2 B09.S1 B09.V2

### Notes on the sheet
- MD Buffer
- D-BS-BM8-L-06 | A

## Sheet 5 of 8
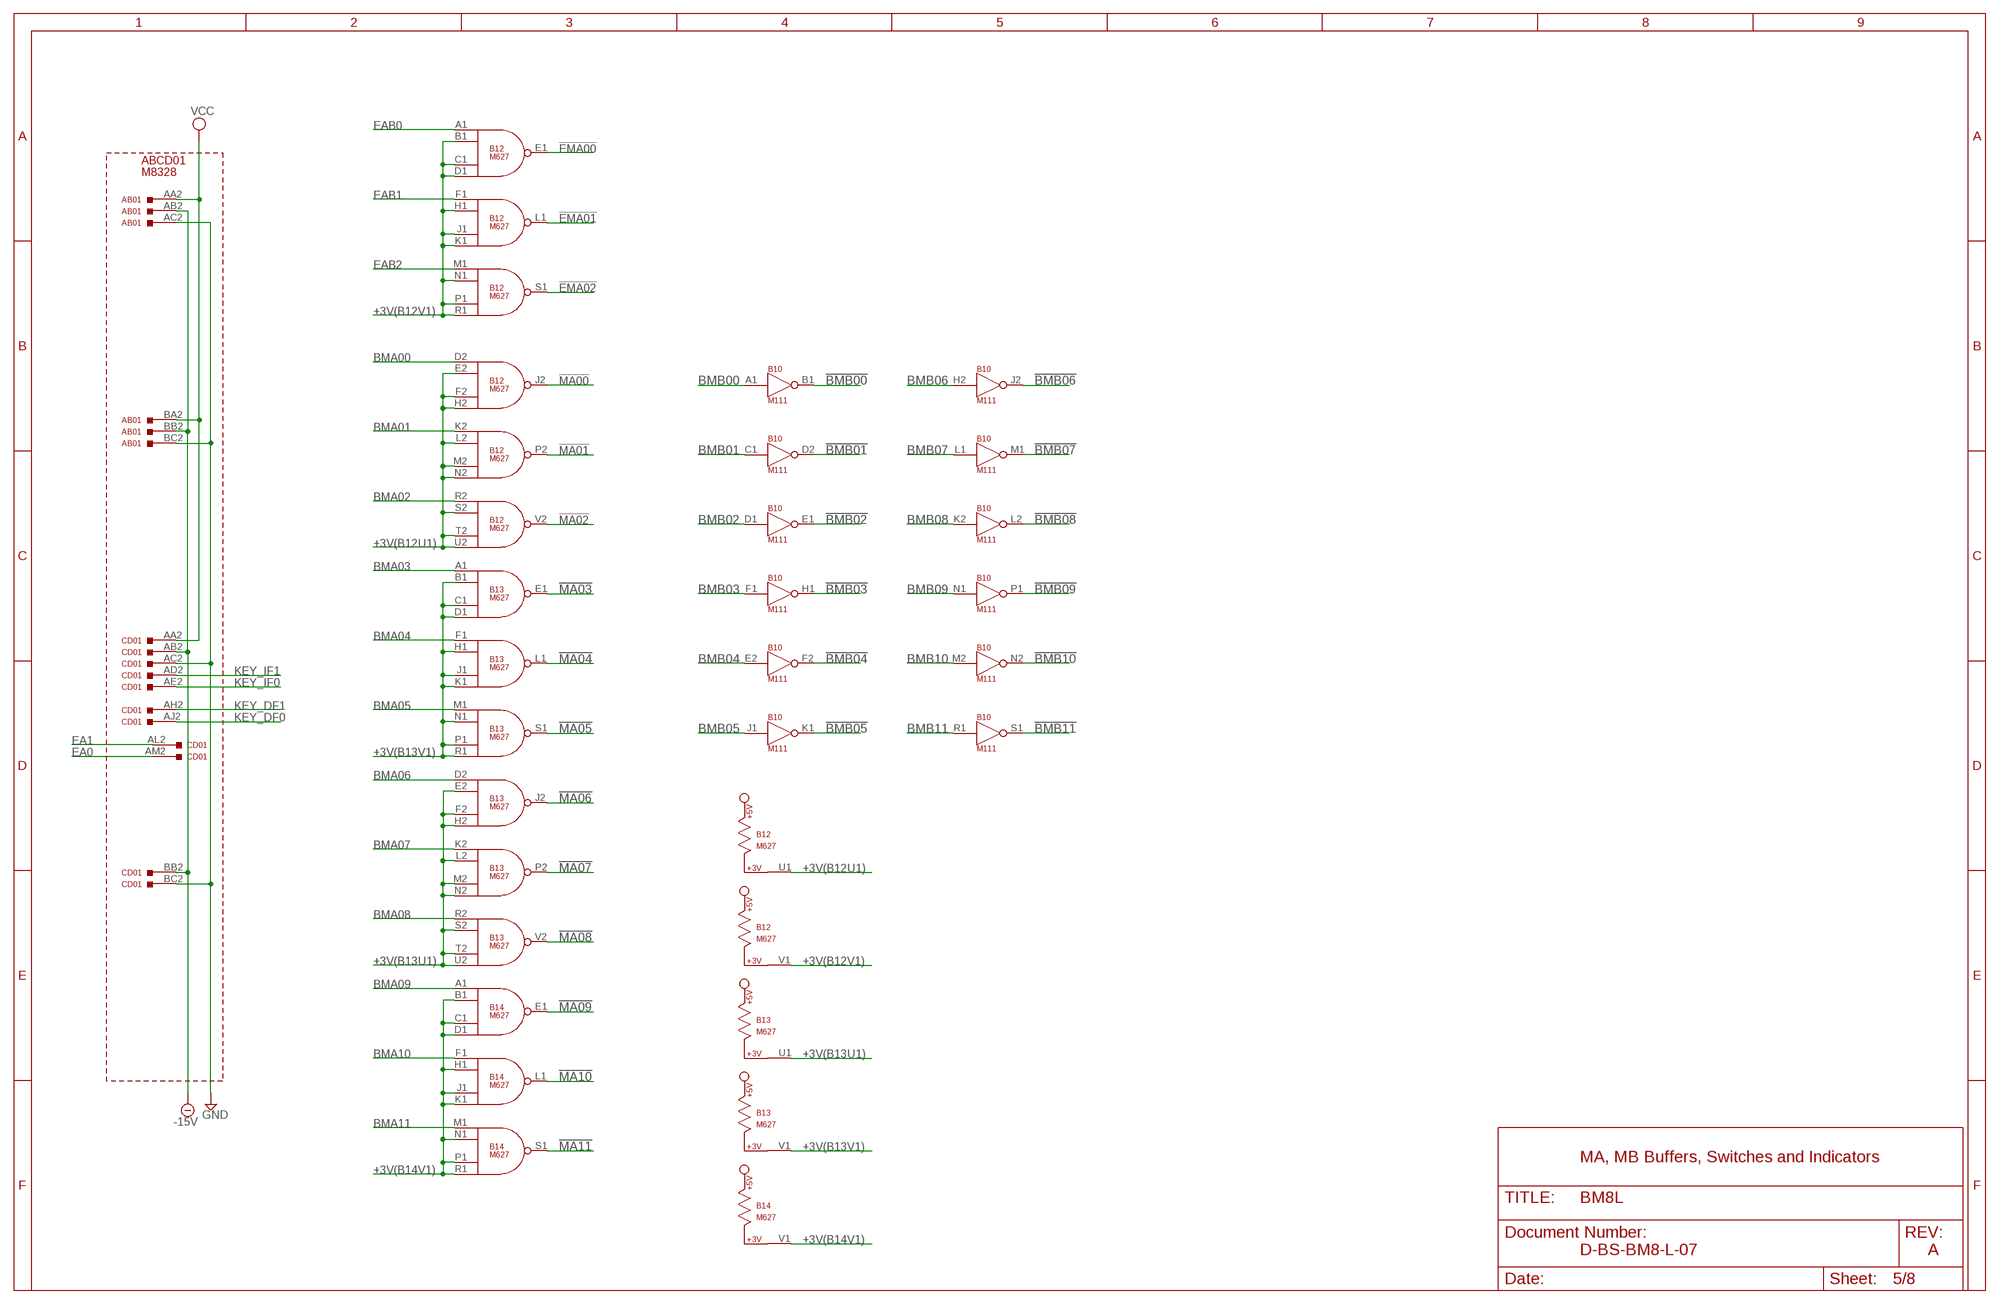
[diagram p4: schematic, sheet 5]

### Parts
AB01  M935  W971  [H807-2]
B12  M627  [H807]
B13  M627  [H807]
CD01  M935  W971  [H807-2]

### Nets
!BMB00: B10.B1(B1:OUT) ; also sheet 4
!BMB01: B10.D2(D2:OUT) ; also sheet 4
!BMB02: B10.E1(E1:OUT) ; also sheet 4
!BMB03: B10.H1(H1:OUT) ; also sheet 2,4,8
!BMB04: B10.F2(F2:OUT) ; also sheet 4,8
!BMB05: B10.K1(K1:OUT) ; also sheet 2,4,8
!BMB06: B10.J2(J2:OUT) ; also sheet 4,8
!BMB07: B10.M1(M1:OUT) ; also sheet 2,4,8
!BMB08: B10.L2(L2:OUT) ; also sheet 2,4,8
!BMB09: B10.P1(P1:OUT) ; also sheet 2,4
!BMB10: B10.N2(N2:OUT) ; also sheet 4
!BMB11: B10.S1(S1:OUT) ; also sheet 4
!EMA00: B12.E1(E1:OUT) ; also sheet 6
!EMA01: B12.L1(L1:OUT) ; also sheet 6
!EMA02: B12.S1(S1:OUT) ; also sheet 6
!MA00: B12.J2(J2:OUT) ; also sheet 6
!MA01: B12.P2(P2:OUT) ; also sheet 6
!MA02: B12.V2(V2:OUT) ; also sheet 6
!MA03: B13.E1(E1:OUT) ; also sheet 6
!MA04: B13.L1(L1:OUT) ; also sheet 6
!MA05: B13.S1(S1:OUT) ; also sheet 6
!MA06: B13.J2(J2:OUT) ; also sheet 6
!MA07: B13.P2(P2:OUT) ; also sheet 6
!MA08: B13.V2(V2:OUT) ; also sheet 6
!MA09: B14.E1(E1:OUT) ; also sheet 6
!MA10: B14.L1(L1:OUT) ; also sheet 6
!MA11: B14.S1(S1:OUT) ; also sheet 6
+3V(B12U1): B12.E2(J2:IN2) B12.F2(J2:IN3) B12.H2(J2:IN4) B12.L2(P2:IN2) B12.M2(P2:IN3) B12.N2(P2:IN4) B12.S2(V2:IN2) B12.T2(V2:IN3) B12.U1 B12.U2(V2:IN4)
+3V(B12V1): B12.B1(E1:IN2) B12.C1(E1:IN3) B12.D1(E1:IN4) B12.H1(L1:IN2) B12.J1(L1:IN3) B12.K1(L1:IN4) B12.N1(S1:IN2) B12.P1(S1:IN3) B12.R1(S1:IN4) B12.V1
+3V(B13U1): B13.E2(J2:IN2) B13.F2(J2:IN3) B13.H2(J2:IN4) B13.L2(P2:IN2) B13.M2(P2:IN3) B13.N2(P2:IN4) B13.S2(V2:IN2) B13.T2(V2:IN3) B13.U1 B13.U2(V2:IN4)
+3V(B13V1): B13.B1(E1:IN2) B13.C1(E1:IN3) B13.D1(E1:IN4) B13.H1(L1:IN2) B13.J1(L1:IN3) B13.K1(L1:IN4) B13.N1(S1:IN2) B13.P1(S1:IN3) B13.R1(S1:IN4) B13.V1
+3V(B14V1): B14.B1(E1:IN2) B14.C1(E1:IN3) B14.D1(E1:IN4) B14.H1(L1:IN2) B14.J1(L1:IN3) B14.K1(L1:IN4) B14.N1(S1:IN2) B14.P1(S1:IN3) B14.R1(S1:IN4) B14.V1
-15V: AB01.AB2 AB01.BB2 CD01.AB2 CD01.BB2 ; also sheet 6
BMA00: B12.D2(J2:IN1) ; also sheet 7
BMA01: B12.K2(P2:IN1) ; also sheet 7
BMA02: B12.R2(V2:IN1) ; also sheet 7
BMA03: B13.A1(E1:IN1) ; also sheet 7
BMA04: B13.F1(L1:IN1) ; also sheet 7
BMA05: B13.M1(S1:IN1) ; also sheet 7
BMA06: B13.D2(J2:IN1) ; also sheet 7
BMA07: B13.K2(P2:IN1) ; also sheet 7
BMA08: B13.R2(V2:IN1) ; also sheet 7
BMA09: B14.A1(E1:IN1) ; also sheet 7
BMA10: B14.F1(L1:IN1) ; also sheet 7
BMA11: B14.M1(S1:IN1) ; also sheet 7
BMB00: B10.A1(B1:IN) ; also sheet 8
BMB01: B10.C1(D2:IN) ; also sheet 8
BMB02: B10.D1(E1:IN) ; also sheet 8
BMB03: B10.F1(H1:IN) ; also sheet 8
BMB04: B10.E2(F2:IN) ; also sheet 2,8
BMB05: B10.J1(K1:IN) ; also sheet 8
BMB06: B10.H2(J2:IN) ; also sheet 2,8
BMB07: B10.L1(M1:IN) ; also sheet 2,8
BMB08: B10.K2(L2:IN) ; also sheet 2,8
BMB09: B10.N1(P1:IN) ; also sheet 2,8
BMB10: B10.M2(N2:IN) ; also sheet 8
BMB11: B10.R1(S1:IN) ; also sheet 8
EA0: CD01.AM2 ; also sheet 1,3,6
EA1: CD01.AL2 ; also sheet 1,3,6
EAB0: B12.A1(E1:IN1) ; also sheet 3
EAB1: B12.F1(L1:IN1) ; also sheet 3
EAB2: B12.M1(S1:IN1) ; also sheet 3
GND: AB01.AC2 AB01.BC2 CD01.AC2 CD01.BC2 ; also sheet 1,2,3,6
KEY_DF0: CD01.AJ2 ; also sheet 2,6
KEY_DF1: CD01.AH2 ; also sheet 2,6
KEY_IF0: CD01.AE2 ; also sheet 2,6
KEY_IF1: CD01.AD2 ; also sheet 2,6
VCC: AB01.AA2 AB01.BA2 CD01.AA2 ; also sheet 6
Unconnected: AB01.AA1 AB01.AB1 AB01.AC1 AB01.AD1 AB01.AD2 AB01.AE1 AB01.AE2 AB01.AF1 AB01.AF2 AB01.AH1 AB01.AH2 AB01.AJ1 AB01.AJ2 AB01.AK1 AB01.AK2 AB01.AL1 AB01.AL2 AB01.AM1 AB01.AM2 AB01.AN1 AB01.AN2 AB01.AP1 AB01.AP2 AB01.AR1 AB01.AR2 AB01.AS1 AB01.AS2 AB01.AT1 AB01.AT2 AB01.AU1 AB01.AU2 AB01.AV1 AB01.AV2 AB01.BA1 AB01.BB1 AB01.BC1 AB01.BD1 AB01.BD2 AB01.BE1 AB01.BE2 AB01.BF1 AB01.BF2 AB01.BH1 AB01.BH2 AB01.BJ1 AB01.BJ2 AB01.BK1 AB01.BK2 AB01.BL1 AB01.BL2 AB01.BM1 AB01.BM2 AB01.BN1 AB01.BN2 AB01.BP1 AB01.BP2 AB01.BR1 AB01.BR2 AB01.BS1 AB01.BS2 AB01.BT1 AB01.BT2 AB01.BU1 AB01.BU2 AB01.BV1 AB01.BV2 CD01.AA1 CD01.AB1 CD01.AC1 CD01.AD1 CD01.AE1 CD01.AF1 CD01.AF2 CD01.AH1 CD01.AJ1 CD01.AK1 CD01.AK2 CD01.AL1 CD01.AM1 CD01.AN1 CD01.AN2 CD01.AP1 CD01.AP2 CD01.AR1 CD01.AR2 CD01.AS1 CD01.AS2 CD01.AT1 CD01.AT2 CD01.AU1 CD01.AU2 CD01.AV1 CD01.AV2 CD01.BA1 CD01.BA2 CD01.BB1 CD01.BC1 CD01.BD1 CD01.BD2 CD01.BE1 CD01.BE2 CD01.BF1 CD01.BF2 CD01.BH1 CD01.BH2 CD01.BJ1 CD01.BJ2 CD01.BK1 CD01.BK2 CD01.BL1 CD01.BL2 CD01.BM1 CD01.BM2 CD01.BN1 CD01.BN2 CD01.BP1 CD01.BP2 CD01.BR1 CD01.BR2 CD01.BS1 CD01.BS2 CD01.BT1 CD01.BT2 CD01.BU1 CD01.BU2 CD01.BV1 CD01.BV2

### Notes on the sheet
- ABCD01
- M8328
- MA, MB Buffers, Switches and Indicators
- D-BS-BM8-L-07 | A

## Sheet 6 of 8
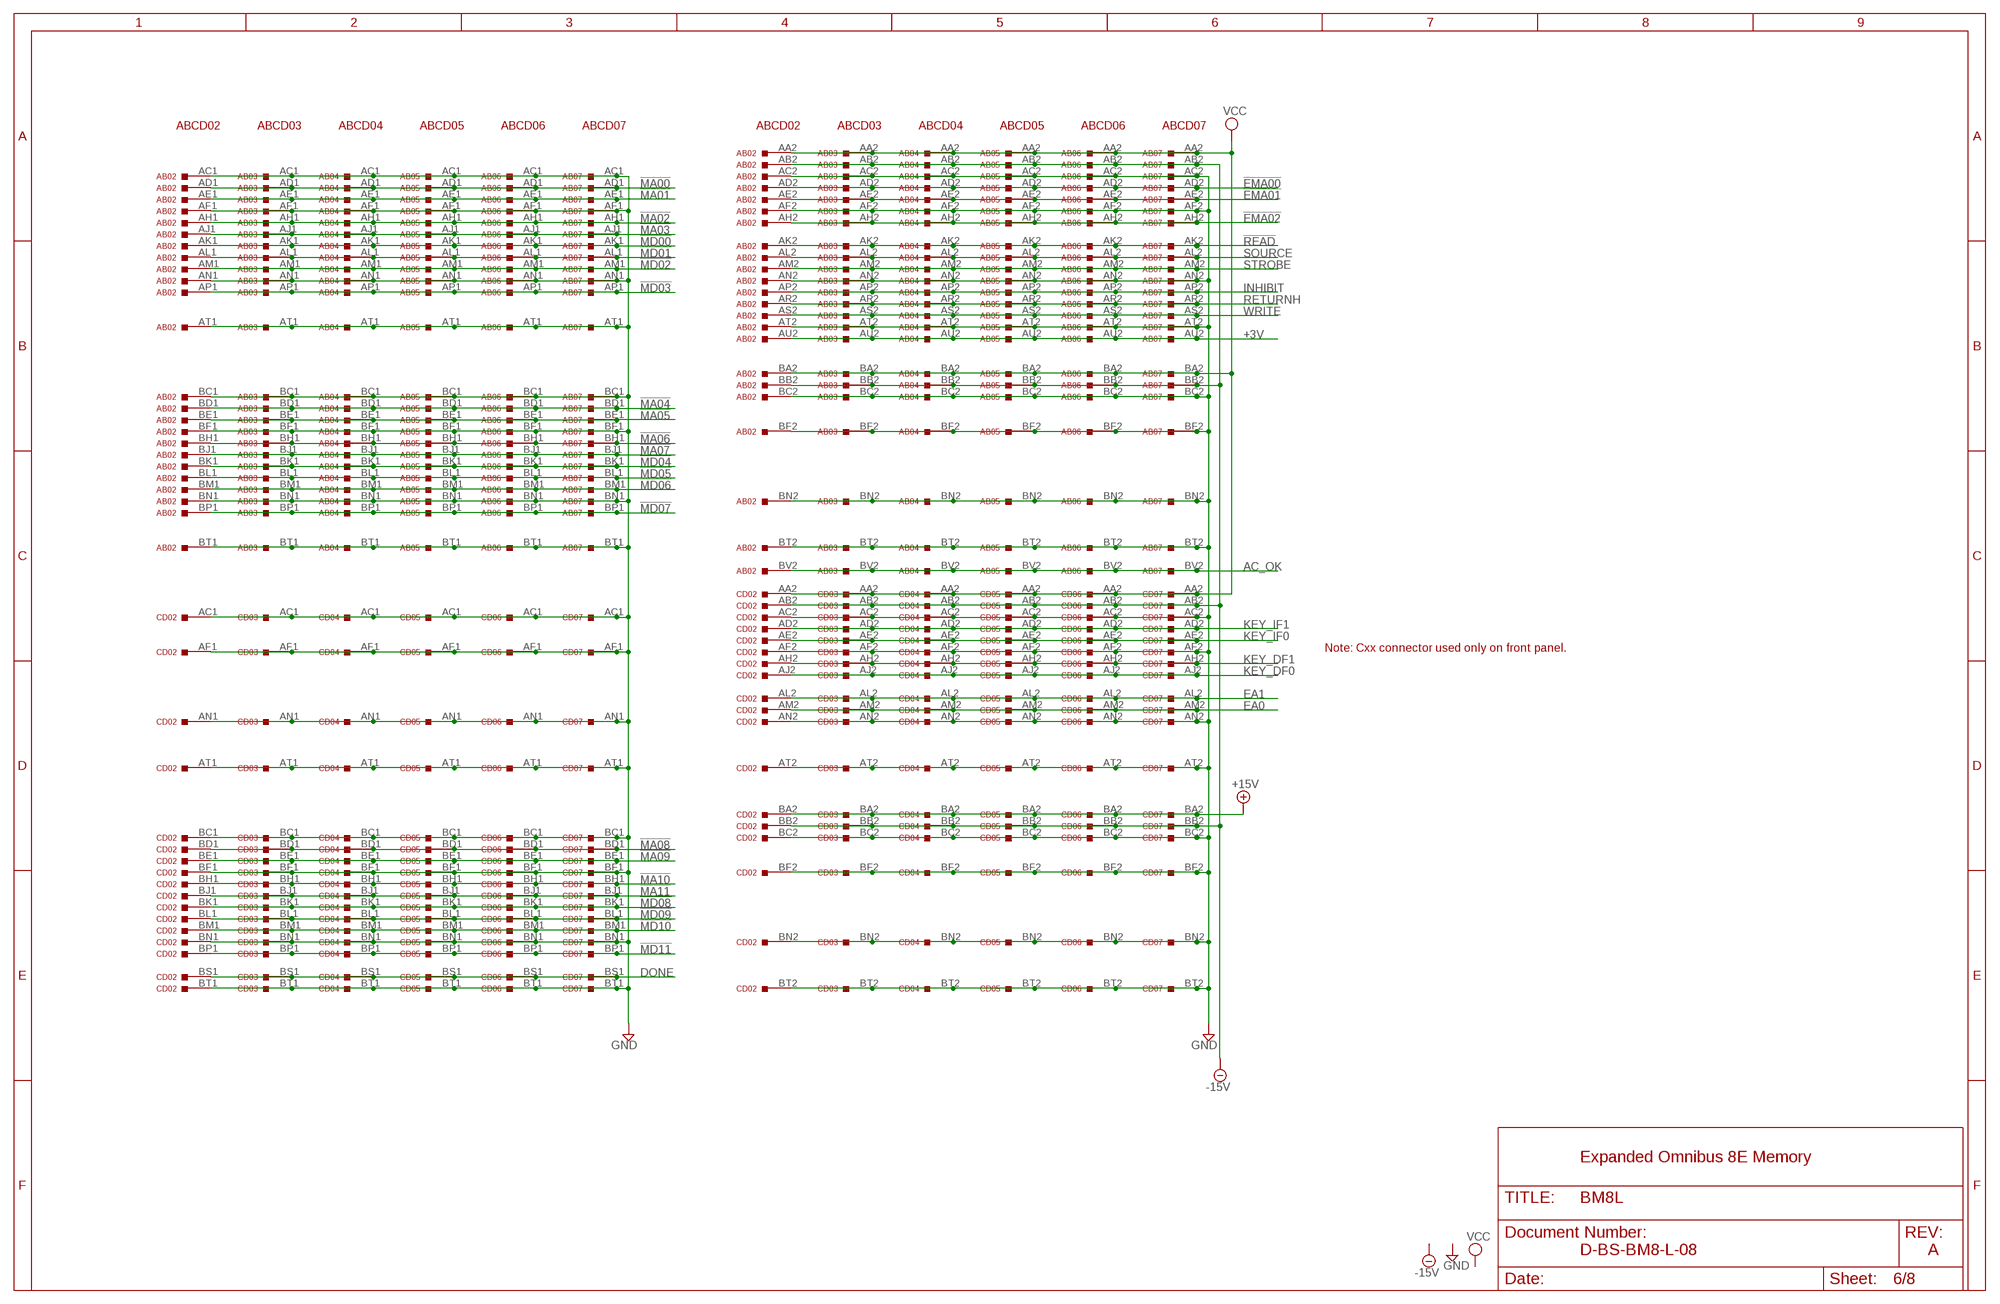
[diagram p5: schematic, sheet 6]

### Parts
AB02  M935  W971  [H807-2]
AB03  M935  W971  [H807-2]
AB04  M935  W971  [H807-2]
AB05  M935  W971  [H807-2]
AB06  M935  W971  [H807-2]
AB07  M849  W971  [H807-2]
CD02  M935  W971  [H807-2]
CD03  M935  W971  [H807-2]
CD04  M935  W971  [H807-2]
CD05  M935  W971  [H807-2]
CD06  M935  W971  [H807-2]
CD07  M849  W971  [H807-2]

### Nets
!EMA00: AB02.AD2 AB03.AD2 AB04.AD2 AB05.AD2 AB06.AD2 AB07.AD2 ; also sheet 5
!EMA01: AB02.AE2 AB03.AE2 AB04.AE2 AB05.AE2 AB06.AE2 AB07.AE2 ; also sheet 5
!EMA02: AB02.AH2 AB03.AH2 AB04.AH2 AB05.AH2 AB06.AH2 AB07.AH2 ; also sheet 5
!MA00: AB02.AD1 AB03.AD1 AB04.AD1 AB05.AD1 AB06.AD1 AB07.AD1 ; also sheet 5
!MA01: AB02.AE1 AB03.AE1 AB04.AE1 AB05.AE1 AB06.AE1 AB07.AE1 ; also sheet 5
!MA02: AB02.AH1 AB03.AH1 AB04.AH1 AB05.AH1 AB06.AH1 AB07.AH1 ; also sheet 5
!MA03: AB02.AJ1 AB03.AJ1 AB04.AJ1 AB05.AJ1 AB06.AJ1 AB07.AJ1 ; also sheet 5
!MA04: AB02.BD1 AB03.BD1 AB04.BD1 AB05.BD1 AB06.BD1 AB07.BD1 ; also sheet 5
!MA05: AB02.BE1 AB03.BE1 AB04.BE1 AB05.BE1 AB06.BE1 AB07.BE1 ; also sheet 5
!MA06: AB02.BH1 AB03.BH1 AB04.BH1 AB05.BH1 AB06.BH1 AB07.BH1 ; also sheet 5
!MA07: AB02.BJ1 AB03.BJ1 AB04.BJ1 AB05.BJ1 AB06.BJ1 AB07.BJ1 ; also sheet 5
!MA08: CD02.BD1 CD03.BD1 CD04.BD1 CD05.BD1 CD06.BD1 CD07.BD1 ; also sheet 5
!MA09: CD02.BE1 CD03.BE1 CD04.BE1 CD05.BE1 CD06.BE1 CD07.BE1 ; also sheet 5
!MA10: CD02.BH1 CD03.BH1 CD04.BH1 CD05.BH1 CD06.BH1 CD07.BH1 ; also sheet 5
!MA11: CD02.BJ1 CD03.BJ1 CD04.BJ1 CD05.BJ1 CD06.BJ1 CD07.BJ1 ; also sheet 5
!MD00: AB02.AK1 AB03.AK1 AB04.AK1 AB05.AK1 AB06.AK1 AB07.AK1
!MD01: AB02.AL1 AB03.AL1 AB04.AL1 AB05.AL1 AB06.AL1 AB07.AL1
!MD02: AB02.AM1 AB03.AM1 AB04.AM1 AB05.AM1 AB06.AM1 AB07.AM1
!MD03: AB02.AP1 AB03.AP1 AB04.AP1 AB05.AP1 AB06.AP1 AB07.AP1
!MD04: AB02.BK1 AB03.BK1 AB04.BK1 AB05.BK1 AB06.BK1 AB07.BK1
!MD05: AB02.BL1 AB03.BL1 AB04.BL1 AB05.BL1 AB06.BL1 AB07.BL1
!MD06: AB02.BM1 AB03.BM1 AB04.BM1 AB05.BM1 AB06.BM1 AB07.BM1
!MD07: AB02.BP1 AB03.BP1 AB04.BP1 AB05.BP1 AB06.BP1 AB07.BP1
!MD08: CD02.BK1 CD03.BK1 CD04.BK1 CD05.BK1 CD06.BK1 CD07.BK1
!MD09: CD02.BL1 CD03.BL1 CD04.BL1 CD05.BL1 CD06.BL1 CD07.BL1
!MD10: CD02.BM1 CD03.BM1 CD04.BM1 CD05.BM1 CD06.BM1 CD07.BM1
!MD11: CD02.BP1 CD03.BP1 CD04.BP1 CD05.BP1 CD06.BP1 CD07.BP1
!READ: AB02.AK2 AB03.AK2 AB04.AK2 AB05.AK2 AB06.AK2 AB07.AK2 ; also sheet 1
+3V: AB02.AU2 AB03.AU2 AB04.AU2 AB05.AU2 AB06.AU2 AB07.AU2
+15V: CD02.BA2 CD03.BA2 CD04.BA2 CD05.BA2 CD06.BA2 CD07.BA2
-15V: AB02.AB2 AB02.BB2 AB03.AB2 AB03.BB2 AB04.AB2 AB04.BB2 AB05.AB2 AB05.BB2 AB06.AB2 AB06.BB2 AB07.AB2 AB07.BB2 CD02.AB2 CD02.BB2 CD03.AB2 CD03.BB2 CD04.AB2 CD04.BB2 CD05.AB2 CD05.BB2 CD06.AB2 CD06.BB2 CD07.AB2 CD07.BB2 ; also sheet 5
AC_OK: AB02.BV2 AB03.BV2 AB04.BV2 AB05.BV2 AB06.BV2 AB07.BV2
DONE: CD02.BS1 CD03.BS1 CD04.BS1 CD05.BS1 CD06.BS1 CD07.BS1 ; also sheet 1
EA0: CD02.AM2 CD03.AM2 CD04.AM2 CD05.AM2 CD06.AM2 CD07.AM2 ; also sheet 1,3,5
EA1: CD02.AL2 CD03.AL2 CD04.AL2 CD05.AL2 CD06.AL2 CD07.AL2 ; also sheet 1,3,5
GND: AB02.AC1 AB02.AC2 AB02.AF1 AB02.AF2 AB02.AN1 AB02.AN2 AB02.AT1 AB02.AT2 AB02.BC1 AB02.BC2 AB02.BF1 AB02.BF2 AB02.BN1 AB02.BN2 AB02.BT1 AB02.BT2 AB03.AC1 AB03.AC2 AB03.AF1 AB03.AF2 AB03.AN1 AB03.AN2 AB03.AT1 AB03.AT2 AB03.BC1 AB03.BC2 AB03.BF1 AB03.BF2 AB03.BN1 AB03.BN2 AB03.BT1 AB03.BT2 AB04.AC1 AB04.AC2 AB04.AF1 AB04.AF2 AB04.AN1 AB04.AN2 AB04.AT1 AB04.AT2 AB04.BC1 AB04.BC2 AB04.BF1 AB04.BF2 AB04.BN1 AB04.BN2 AB04.BT1 AB04.BT2 AB05.AC1 AB05.AC2 AB05.AF1 AB05.AF2 AB05.AN1 AB05.AN2 AB05.AT1 AB05.AT2 AB05.BC1 AB05.BC2 AB05.BF1 AB05.BF2 AB05.BN1 AB05.BN2 AB05.BT1 AB05.BT2 AB06.AC1 AB06.AC2 AB06.AF1 AB06.AF2 AB06.AN1 AB06.AN2 AB06.AT1 AB06.AT2 AB06.BC1 AB06.BC2 AB06.BF1 AB06.BF2 AB06.BN1 AB06.BN2 AB06.BT1 AB06.BT2 AB07.AC1 AB07.AC2 AB07.AF1 AB07.AF2 AB07.AN1 AB07.AN2 AB07.AT1 AB07.AT2 AB07.BC1 AB07.BC2 AB07.BF1 AB07.BF2 AB07.BN1 AB07.BN2 AB07.BT1 AB07.BT2 CD02.AC1 CD02.AC2 CD02.AF1 CD02.AF2 CD02.AN1 CD02.AN2 CD02.AT1 CD02.AT2 CD02.BC1 CD02.BC2 CD02.BF1 CD02.BF2 CD02.BN1 CD02.BN2 CD02.BT1 CD02.BT2 CD03.AC1 CD03.AC2 CD03.AF1 CD03.AF2 CD03.AN1 CD03.AN2 CD03.AT1 CD03.AT2 CD03.BC1 CD03.BC2 CD03.BF1 CD03.BF2 CD03.BN1 CD03.BN2 CD03.BT1 CD03.BT2 CD04.AC1 CD04.AC2 CD04.AF1 CD04.AF2 CD04.AN1 CD04.AN2 CD04.AT1 CD04.AT2 CD04.BC1 CD04.BC2 CD04.BF1 CD04.BF2 CD04.BN1 CD04.BN2 CD04.BT1 CD04.BT2 CD05.AC1 CD05.AC2 CD05.AF1 CD05.AF2 CD05.AN1 CD05.AN2 CD05.AT1 CD05.AT2 CD05.BC1 CD05.BC2 CD05.BF1 CD05.BF2 CD05.BN1 CD05.BN2 CD05.BT1 CD05.BT2 CD06.AC1 CD06.AC2 CD06.AF1 CD06.AF2 CD06.AN1 CD06.AN2 CD06.AT1 CD06.AT2 CD06.BC1 CD06.BC2 CD06.BF1 CD06.BF2 CD06.BN1 CD06.BN2 CD06.BT1 CD06.BT2 CD07.AC1 CD07.AC2 CD07.AF1 CD07.AF2 CD07.AN1 CD07.AN2 CD07.AT1 CD07.AT2 CD07.BC1 CD07.BC2 CD07.BF1 CD07.BF2 CD07.BN1 CD07.BN2 CD07.BT1 CD07.BT2 ; also sheet 1,2,3,5
INHIBIT: AB02.AP2 AB03.AP2 AB04.AP2 AB05.AP2 AB06.AP2 AB07.AP2 ; also sheet 1
KEY_DF0: CD02.AJ2 CD03.AJ2 CD04.AJ2 CD05.AJ2 CD06.AJ2 CD07.AJ2 ; also sheet 2,5
KEY_DF1: CD02.AH2 CD03.AH2 CD04.AH2 CD05.AH2 CD06.AH2 CD07.AH2 ; also sheet 2,5
KEY_IF0: CD02.AE2 CD03.AE2 CD04.AE2 CD05.AE2 CD06.AE2 CD07.AE2 ; also sheet 2,5
KEY_IF1: CD02.AD2 CD03.AD2 CD04.AD2 CD05.AD2 CD06.AD2 CD07.AD2 ; also sheet 2,5
RETURNH: AB02.AR2 AB03.AR2 AB04.AR2 AB05.AR2 AB06.AR2 AB07.AR2 ; also sheet 1
SOURCE: AB02.AL2 AB03.AL2 AB04.AL2 AB05.AL2 AB06.AL2 AB07.AL2 ; also sheet 1
STROBE: AB02.AM2 AB03.AM2 AB04.AM2 AB05.AM2 AB06.AM2 AB07.AM2 ; also sheet 1
VCC: AB02.AA2 AB02.BA2 AB03.AA2 AB03.BA2 AB04.AA2 AB04.BA2 AB05.AA2 AB05.BA2 AB06.AA2 AB06.BA2 AB07.AA2 AB07.BA2 CD02.AA2 CD03.AA2 CD04.AA2 CD05.AA2 CD06.AA2 CD07.AA2 ; also sheet 5
WRITE: AB02.AS2 AB03.AS2 AB04.AS2 AB05.AS2 AB06.AS2 AB07.AS2 ; also sheet 1,3,4
Unconnected: AB02.AA1 AB02.AB1 AB02.AJ2 AB02.AR1 AB02.AS1 AB02.AU1 AB02.AV1 AB02.AV2 AB02.BA1 AB02.BB1 AB02.BD2 AB02.BE2 AB02.BH2 AB02.BJ2 AB02.BK2 AB02.BL2 AB02.BM2 AB02.BP2 AB02.BR1 AB02.BR2 AB02.BS1 AB02.BS2 AB02.BU1 AB02.BU2 AB02.BV1 AB03.AA1 AB03.AB1 AB03.AJ2 AB03.AR1 AB03.AS1 AB03.AU1 AB03.AV1 AB03.AV2 AB03.BA1 AB03.BB1 AB03.BD2 AB03.BE2 AB03.BH2 AB03.BJ2 AB03.BK2 AB03.BL2 AB03.BM2 AB03.BP2 AB03.BR1 AB03.BR2 AB03.BS1 AB03.BS2 AB03.BU1 AB03.BU2 AB03.BV1 AB04.AA1 AB04.AB1 AB04.AJ2 AB04.AR1 AB04.AS1 AB04.AU1 AB04.AV1 AB04.AV2 AB04.BA1 AB04.BB1 AB04.BD2 AB04.BE2 AB04.BH2 AB04.BJ2 AB04.BK2 AB04.BL2 AB04.BM2 AB04.BP2 AB04.BR1 AB04.BR2 AB04.BS1 AB04.BS2 AB04.BU1 AB04.BU2 AB04.BV1 AB05.AA1 AB05.AB1 AB05.AJ2 AB05.AR1 AB05.AS1 AB05.AU1 AB05.AV1 AB05.AV2 AB05.BA1 AB05.BB1 AB05.BD2 AB05.BE2 AB05.BH2 AB05.BJ2 AB05.BK2 AB05.BL2 AB05.BM2 AB05.BP2 AB05.BR1 AB05.BR2 AB05.BS1 AB05.BS2 AB05.BU1 AB05.BU2 AB05.BV1 AB06.AA1 AB06.AB1 AB06.AJ2 AB06.AR1 AB06.AS1 AB06.AU1 AB06.AV1 AB06.AV2 AB06.BA1 AB06.BB1 AB06.BD2 AB06.BE2 AB06.BH2 AB06.BJ2 AB06.BK2 AB06.BL2 AB06.BM2 AB06.BP2 AB06.BR1 AB06.BR2 AB06.BS1 AB06.BS2 AB06.BU1 AB06.BU2 AB06.BV1 AB07.AA1 AB07.AB1 AB07.AJ2 AB07.AR1 AB07.AS1 AB07.AU1 AB07.AV1 AB07.AV2 AB07.BA1 AB07.BB1 AB07.BD2 AB07.BE2 AB07.BH2 AB07.BJ2 AB07.BK2 AB07.BL2 AB07.BM2 AB07.BP2 AB07.BR1 AB07.BR2 AB07.BS1 AB07.BS2 AB07.BU1 AB07.BU2 AB07.BV1 CD02.AA1 CD02.AB1 CD02.AD1 CD02.AE1 CD02.AH1 CD02.AJ1 CD02.AK1 CD02.AK2 CD02.AL1 CD02.AM1 CD02.AP1 CD02.AP2 CD02.AR1 CD02.AR2 CD02.AS1 CD02.AS2 CD02.AU1 CD02.AU2 CD02.AV1 CD02.AV2 CD02.BA1 CD02.BB1 CD02.BD2 CD02.BE2 CD02.BH2 CD02.BJ2 CD02.BK2 CD02.BL2 CD02.BM2 CD02.BP2 CD02.BR1 CD02.BR2 CD02.BS2 CD02.BU1 CD02.BU2 CD02.BV1 CD02.BV2 CD03.AA1 CD03.AB1 CD03.AD1 CD03.AE1 CD03.AH1 CD03.AJ1 CD03.AK1 CD03.AK2 CD03.AL1 CD03.AM1 CD03.AP1 CD03.AP2 CD03.AR1 CD03.AR2 CD03.AS1 CD03.AS2 CD03.AU1 CD03.AU2 CD03.AV1 CD03.AV2 CD03.BA1 CD03.BB1 CD03.BD2 CD03.BE2 CD03.BH2 CD03.BJ2 CD03.BK2 CD03.BL2 CD03.BM2 CD03.BP2 CD03.BR1 CD03.BR2 CD03.BS2 CD03.BU1 CD03.BU2 CD03.BV1 CD03.BV2 CD04.AA1 CD04.AB1 CD04.AD1 CD04.AE1 CD04.AH1 CD04.AJ1 CD04.AK1 CD04.AK2 CD04.AL1 CD04.AM1 CD04.AP1 CD04.AP2 CD04.AR1 CD04.AR2 CD04.AS1 CD04.AS2 CD04.AU1 CD04.AU2 CD04.AV1 CD04.AV2 CD04.BA1 CD04.BB1 CD04.BD2 CD04.BE2 CD04.BH2 CD04.BJ2 CD04.BK2 CD04.BL2 CD04.BM2 CD04.BP2 CD04.BR1 CD04.BR2 CD04.BS2 CD04.BU1 CD04.BU2 CD04.BV1 CD04.BV2 CD05.AA1 CD05.AB1 CD05.AD1 CD05.AE1 CD05.AH1 CD05.AJ1 CD05.AK1 CD05.AK2 CD05.AL1 CD05.AM1 CD05.AP1 CD05.AP2 CD05.AR1 CD05.AR2 CD05.AS1 CD05.AS2 CD05.AU1 CD05.AU2 CD05.AV1 CD05.AV2 CD05.BA1 CD05.BB1 CD05.BD2 CD05.BE2 CD05.BH2 CD05.BJ2 CD05.BK2 CD05.BL2 CD05.BM2 CD05.BP2 CD05.BR1 CD05.BR2 CD05.BS2 CD05.BU1 CD05.BU2 CD05.BV1 CD05.BV2 CD06.AA1 CD06.AB1 CD06.AD1 CD06.AE1 CD06.AH1 CD06.AJ1 CD06.AK1 CD06.AK2 CD06.AL1 CD06.AM1 CD06.AP1 CD06.AP2 CD06.AR1 CD06.AR2 CD06.AS1 CD06.AS2 CD06.AU1 CD06.AU2 CD06.AV1 CD06.AV2 CD06.BA1 CD06.BB1 CD06.BD2 CD06.BE2 CD06.BH2 CD06.BJ2 CD06.BK2 CD06.BL2 CD06.BM2 CD06.BP2 CD06.BR1 CD06.BR2 CD06.BS2 CD06.BU1 CD06.BU2 CD06.BV1 CD06.BV2 CD07.AA1 CD07.AB1 CD07.AD1 CD07.AE1 CD07.AH1 CD07.AJ1 CD07.AK1 CD07.AK2 CD07.AL1 CD07.AM1 CD07.AP1 CD07.AP2 CD07.AR1 CD07.AR2 CD07.AS1 CD07.AS2 CD07.AU1 CD07.AU2 CD07.AV1 CD07.AV2 CD07.BA1 CD07.BB1 CD07.BD2 CD07.BE2 CD07.BH2 CD07.BJ2 CD07.BK2 CD07.BL2 CD07.BM2 CD07.BP2 CD07.BR1 CD07.BR2 CD07.BS2 CD07.BU1 CD07.BU2 CD07.BV1 CD07.BV2

### Notes on the sheet
- ABCD02 | ABCD03 | ABCD04 | ABCD05 | ABCD06 | ABCD07 | ABCD02 | ABCD03 | ABCD04 | ABCD05 | ABCD06 | ABCD07
- Note: Cxx connector used only on front panel.
- Expanded Omnibus 8E Memory
- D-BS-BM8-L-08 | A

## Sheet 7 of 8
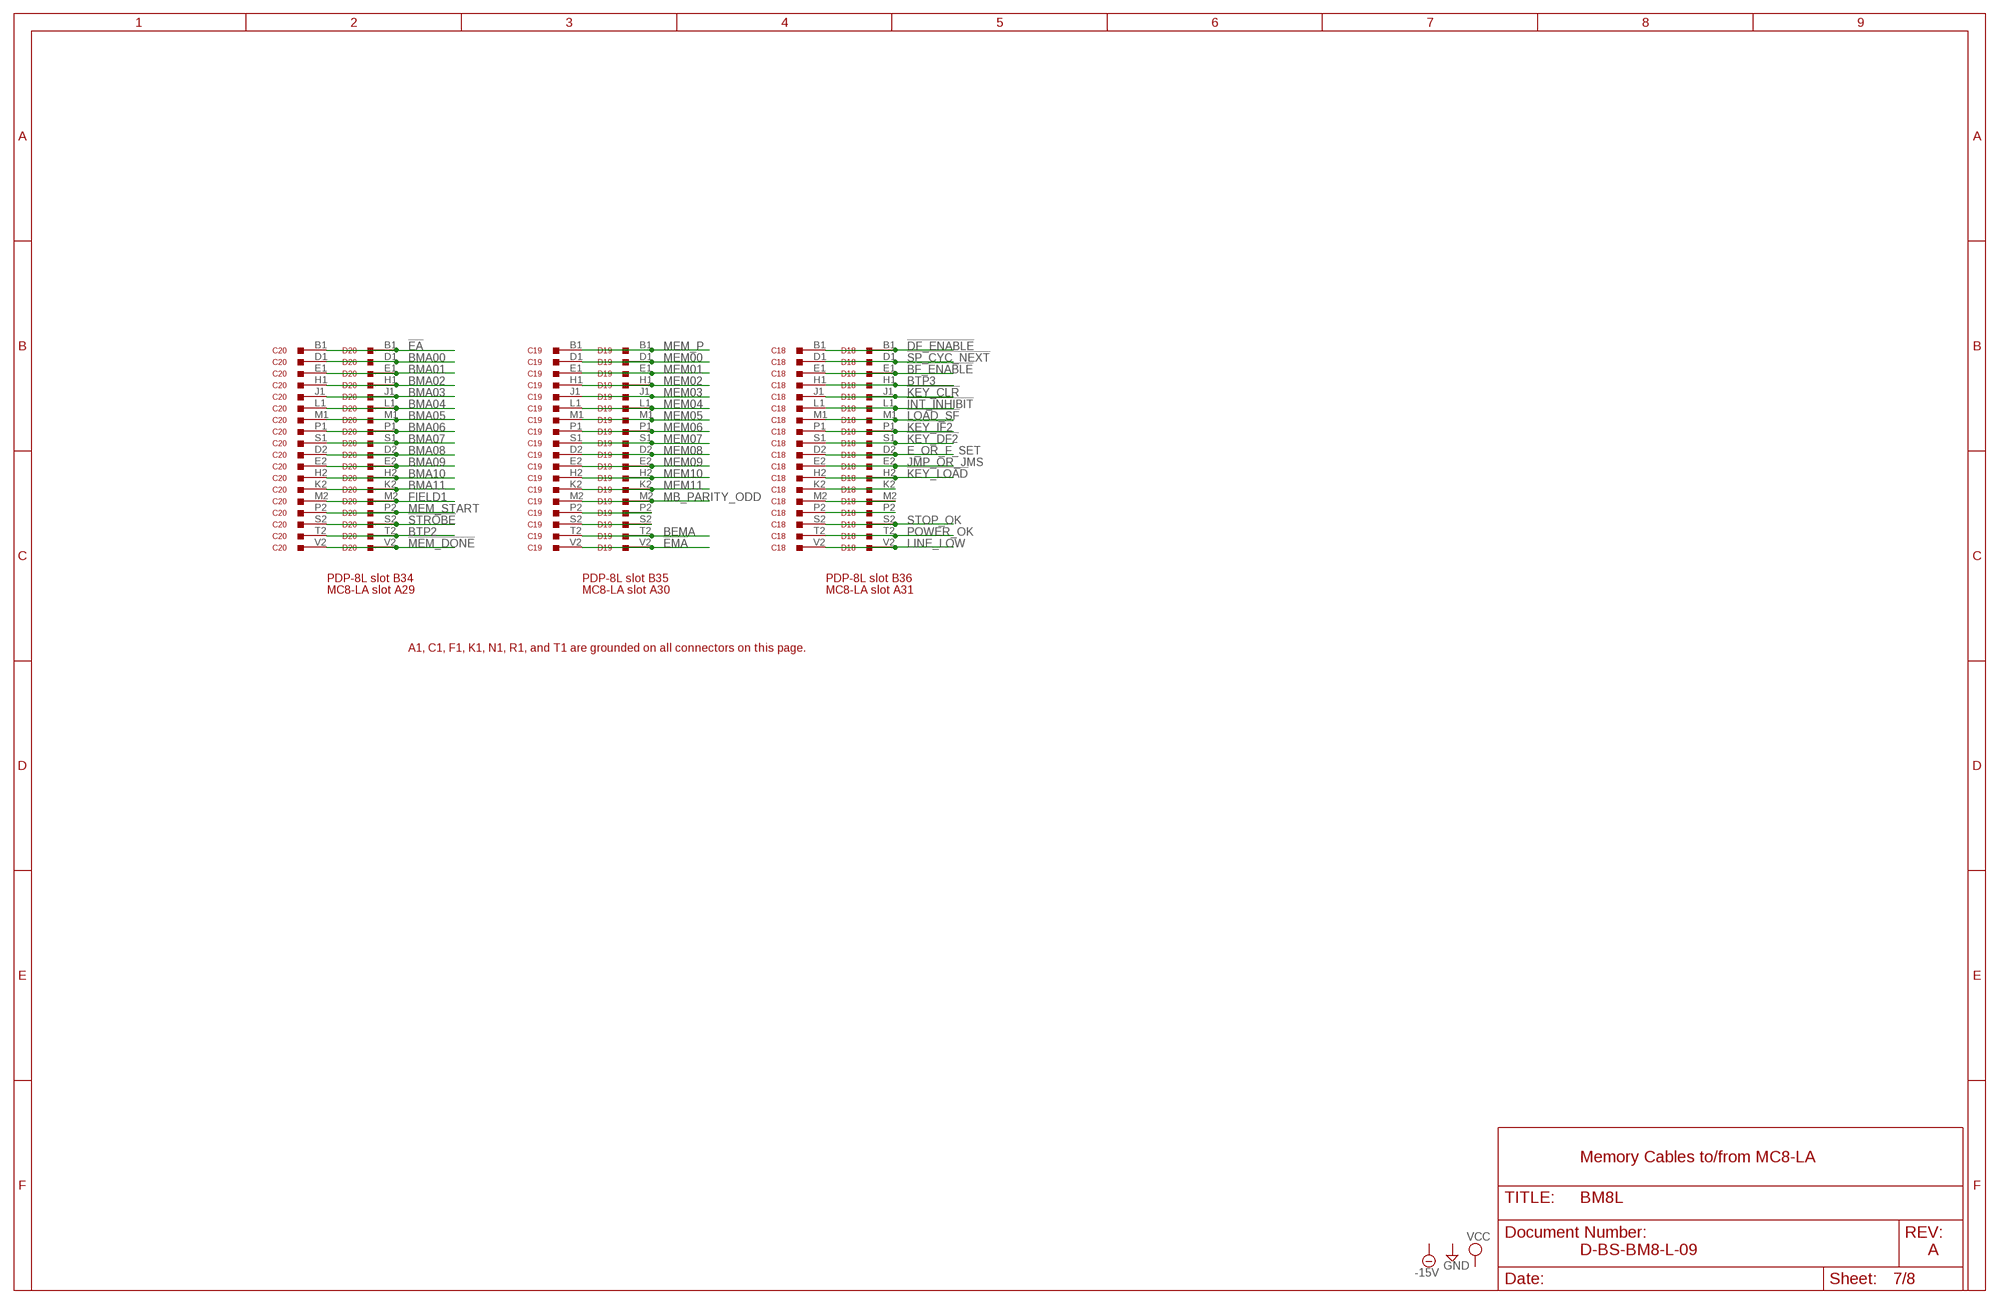
[diagram p6: schematic, sheet 7]

### Parts
C18  M903  [H807]
C19  M903  [H807]
C20  M903  [H807]
D18  M903  [H807]
D19  M903  [H807]
D20  M903  [H807]

### Nets
!BF_ENABLE: C18.E1 D18.E1 ; also sheet 2
!DF_ENABLE: C18.B1 D18.B1 ; also sheet 2
!EA: C20.B1 D20.B1 ; also sheet 1
!EMA: C19.V2 D19.V2 ; also sheet 1
!INT_INHIBIT: C18.L1 D18.L1 ; also sheet 3
!KEY_CLR: C18.J1 D18.J1 ; also sheet 3
!KEY_DF2: C18.S1 D18.S1 ; also sheet 2
!KEY_IF2: C18.P1 D18.P1 ; also sheet 2
!KEY_LOAD: C18.H2 D18.H2 ; also sheet 2
!LOAD_SF: C18.M1 D18.M1 ; also sheet 3
!MEM_DONE: C20.V2 D20.V2 ; also sheet 1
!SP_CYC_NEXT: C18.D1 D18.D1 ; also sheet 2
!STROBE: C20.S2 D20.S2 ; also sheet 1
BEMA: C19.T2 D19.T2 ; also sheet 1
BMA00: C20.D1 D20.D1 ; also sheet 5
BMA01: C20.E1 D20.E1 ; also sheet 5
BMA02: C20.H1 D20.H1 ; also sheet 5
BMA03: C20.J1 D20.J1 ; also sheet 5
BMA04: C20.L1 D20.L1 ; also sheet 5
BMA05: C20.M1 D20.M1 ; also sheet 5
BMA06: C20.P1 D20.P1 ; also sheet 5
BMA07: C20.S1 D20.S1 ; also sheet 5
BMA08: C20.D2 D20.D2 ; also sheet 5
BMA09: C20.E2 D20.E2 ; also sheet 5
BMA10: C20.H2 D20.H2 ; also sheet 5
BMA11: C20.K2 D20.K2 ; also sheet 5
BTP2: C20.T2 D20.T2 ; also sheet 1
BTP3: C18.H1 D18.H1 ; also sheet 3
E_OR_F_SET: C18.D2 D18.D2 ; also sheet 2,3
FIELD1: C20.M2 D20.M2 ; also sheet 3
JMP_OR_JMS: C18.E2 D18.E2 ; also sheet 2,3
LINE_LOW: C18.V2 D18.V2
MB_PARITY_ODD: C19.M2 D19.M2
MEM00: C19.D1 D19.D1 ; also sheet 4
MEM01: C19.E1 D19.E1 ; also sheet 4
MEM02: C19.H1 D19.H1 ; also sheet 4
MEM03: C19.J1 D19.J1 ; also sheet 4
MEM04: C19.L1 D19.L1 ; also sheet 4
MEM05: C19.M1 D19.M1 ; also sheet 4
MEM06: C19.P1 D19.P1 ; also sheet 4
MEM07: C19.S1 D19.S1 ; also sheet 4
MEM08: C19.D2 D19.D2 ; also sheet 4
MEM09: C19.E2 D19.E2 ; also sheet 4
MEM10: C19.H2 D19.H2 ; also sheet 4
MEM11: C19.K2 D19.K2 ; also sheet 4
MEM_P: C19.B1 D19.B1
MEM_START: C20.P2 D20.P2 ; also sheet 1,3
N$83: C19.P2 D19.P2
N$84: C19.S2 D19.S2
N$89: C18.P2 D18.P2
N$90: C18.M2 D18.M2
N$91: C18.K2 D18.K2
POWER_OK: C18.T2 D18.T2 ; also sheet 1
STOP_OK: C18.S2 D18.S2

### Notes on the sheet
- PDP-8L slot B34 | PDP-8L slot B35 | PDP-8L slot B36
- MC8-LA slot A29 | MC8-LA slot A30 | MC8-LA slot A31
- A1, C1, F1, K1, N1, R1, and T1 are grounded on all connectors on this page.
- Memory Cables to/from MC8-LA
- D-BS-BM8-L-09 | A

## Sheet 8 of 8
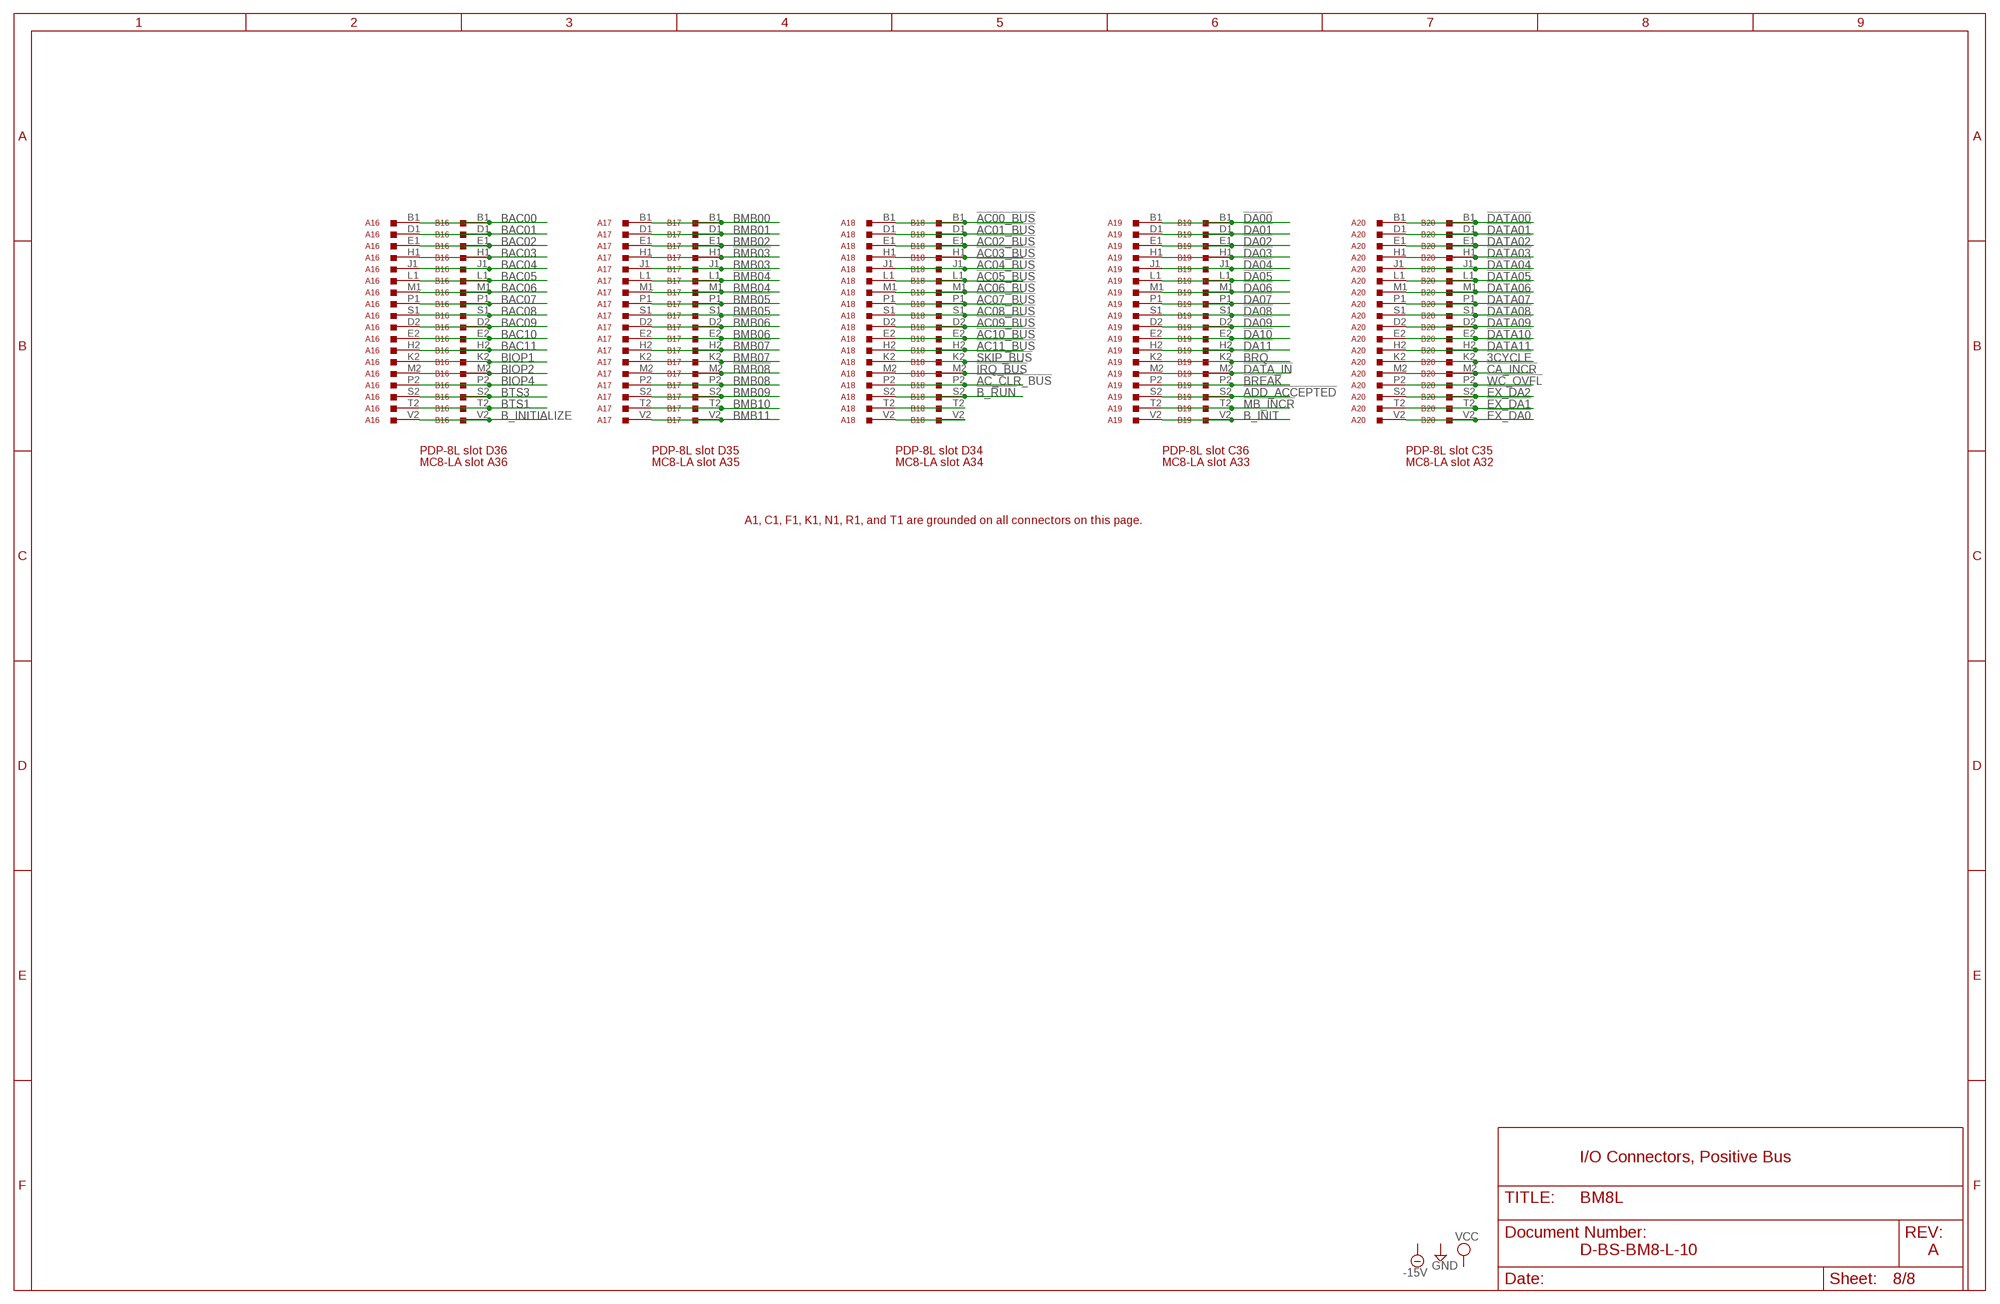
[diagram p7: schematic, sheet 8]

### Parts
A16  M903  [H807]
A17  M903  [H807]
A18  M903  [H807]
A19  M903  [H807]
A20  M903  [H807]
B16  M903  [H807]
B17  M903  [H807]
B18  M903  [H807]
B19  M903  [H807]
B20  M903  [H807]

### Nets
!3CYCLE: A20.K2 B20.K2
!AC00_BUS: A18.B1 B18.B1
!AC01_BUS: A18.D1 B18.D1
!AC02_BUS: A18.E1 B18.E1
!AC03_BUS: A18.H1 B18.H1
!AC04_BUS: A18.J1 B18.J1
!AC05_BUS: A18.L1 B18.L1
!AC06_BUS: A18.M1 B18.M1 ; also sheet 2
!AC07_BUS: A18.P1 B18.P1 ; also sheet 2
!AC08_BUS: A18.S1 B18.S1 ; also sheet 2
!AC09_BUS: A18.D2 B18.D2 ; also sheet 2
!AC10_BUS: A18.E2 B18.E2 ; also sheet 2
!AC11_BUS: A18.H2 B18.H2 ; also sheet 2
!AC_CLR_BUS: A18.P2 B18.P2
!ADD_ACCEPTED: A19.S2 B19.S2
!B_RUN: A18.S2 B18.S2
!BMB03: A17.H1 B17.H1 ; also sheet 2,4,5
!BMB04: A17.L1 B17.L1 ; also sheet 4,5
!BMB05: A17.P1 B17.P1 ; also sheet 2,4,5
!BMB06: A17.D2 B17.D2 ; also sheet 4,5
!BMB07: A17.H2 B17.H2 ; also sheet 2,4,5
!BMB08: A17.M2 B17.M2 ; also sheet 2,4,5
!BREAK: A19.P2 B19.P2
!BRQ: A19.K2 B19.K2
!CA_INCR: A20.M2 B20.M2
!DA00: A19.B1 B19.B1
!DA01: A19.D1 B19.D1
!DA02: A19.E1 B19.E1
!DA03: A19.H1 B19.H1
!DA04: A19.J1 B19.J1
!DA05: A19.L1 B19.L1
!DA06: A19.M1 B19.M1
!DA07: A19.P1 B19.P1
!DA08: A19.S1 B19.S1
!DA09: A19.D2 B19.D2
!DA10: A19.E2 B19.E2
!DA11: A19.H2 B19.H2
!DATA00: A20.B1 B20.B1
!DATA01: A20.D1 B20.D1
!DATA02: A20.E1 B20.E1
!DATA03: A20.H1 B20.H1
!DATA04: A20.J1 B20.J1
!DATA05: A20.L1 B20.L1
!DATA06: A20.M1 B20.M1
!DATA07: A20.P1 B20.P1
!DATA08: A20.S1 B20.S1
!DATA09: A20.D2 B20.D2
!DATA10: A20.E2 B20.E2
!DATA11: A20.H2 B20.H2
!DATA_IN: A19.M2 B19.M2
!EX_DA0: A20.V2 B20.V2 ; also sheet 3
!EX_DA1: A20.T2 B20.T2 ; also sheet 3
!EX_DA2: A20.S2 B20.S2 ; also sheet 3
!IRQ_BUS: A18.M2 B18.M2
!MB_INCR: A19.T2 B19.T2
!SKIP_BUS: A18.K2 B18.K2
!WC_OVFL: A20.P2 B20.P2
B_INIT: A19.V2 B19.V2 ; also sheet 1,4
B_INITIALIZE: A16.V2 B16.V2
BAC00: A16.B1 B16.B1
BAC01: A16.D1 B16.D1
BAC02: A16.E1 B16.E1
BAC03: A16.H1 B16.H1
BAC04: A16.J1 B16.J1
BAC05: A16.L1 B16.L1
BAC06: A16.M1 B16.M1
BAC07: A16.P1 B16.P1
BAC08: A16.S1 B16.S1
BAC09: A16.D2 B16.D2
BAC10: A16.E2 B16.E2
BAC11: A16.H2 B16.H2
BIOP1: A16.K2 B16.K2 ; also sheet 2
BIOP2: A16.M2 B16.M2 ; also sheet 2
BIOP4: A16.P2 B16.P2 ; also sheet 2
BMB00: A17.B1 B17.B1 ; also sheet 5
BMB01: A17.D1 B17.D1 ; also sheet 5
BMB02: A17.E1 B17.E1 ; also sheet 5
BMB03: A17.J1 B17.J1 ; also sheet 5
BMB04: A17.M1 B17.M1 ; also sheet 2,5
BMB05: A17.S1 B17.S1 ; also sheet 5
BMB06: A17.E2 B17.E2 ; also sheet 2,5
BMB07: A17.K2 B17.K2 ; also sheet 2,5
BMB08: A17.P2 B17.P2 ; also sheet 2,5
BMB09: A17.S2 B17.S2 ; also sheet 2,5
BMB10: A17.T2 B17.T2 ; also sheet 5
BMB11: A17.V2 B17.V2 ; also sheet 5
BTS1: A16.T2 B16.T2
BTS3: A16.S2 B16.S2
N$119: A18.V2 B18.V2
N$120: A18.T2 B18.T2

### Notes on the sheet
- PDP-8L slot D36 | PDP-8L slot D35 | PDP-8L slot D34 | PDP-8L slot C36 | PDP-8L slot C35
- MC8-LA slot A36 | MC8-LA slot A35 | MC8-LA slot A34 | MC8-LA slot A33 | MC8-LA slot A32
- A1, C1, F1, K1, N1, R1, and T1 are grounded on all connectors on this page.
- I/O Connectors, Positive Bus
- D-BS-BM8-L-10 | A

## Power pins joined to a net without a drawn wire
-15V: A11.B2 A12.B2 A13.B2 A15.B2
GND: A08.C2(GND) A08.T1(GND) A09.C2(GND) A09.T1(GND) A10.C2(GND) A10.T1(GND) A11.C2 A12.C2 A13.C2 A14.C2(GND) A14.T1(GND) A14.U1(GND) A14.V1(GND) A15.C2 A16.A1 A16.C1 A16.C2 A16.F1 A16.F2 A16.J2 A16.K1 A16.L2 A16.N1 A16.N2 A16.R1 A16.R2 A16.T1 A16.U2 A17.A1 A17.C1 A17.C2 A17.F1 A17.F2 A17.J2 A17.K1 A17.L2 A17.N1 A17.N2 A17.R1 A17.R2 A17.T1 A17.U2 A18.A1 A18.C1 A18.C2 A18.F1 A18.F2 A18.J2 A18.K1 A18.L2 A18.N1 A18.N2 A18.R1 A18.R2 A18.T1 A18.U2 A19.A1 A19.C1 A19.C2 A19.F1 A19.F2 A19.J2 A19.K1 A19.L2 A19.N1 A19.N2 A19.R1 A19.R2 A19.T1 A19.U2 A20.A1 A20.C1 A20.C2 A20.F1 A20.F2 A20.J2 A20.K1 A20.L2 A20.N1 A20.N2 A20.R1 A20.R2 A20.T1 A20.U2 B08.C2(GND) B08.T1(GND) B08.U1(GND) B08.V1(GND) B09.C2(GND) B09.T1(GND) B10.C2(GND) B10.T1(GND) B11.C2(GND) B11.T1(GND) B11.U1(GND) B11.V1(GND) B12.C2(GND) B12.T1(GND) B13.C2(GND) B13.T1(GND) B14.C2(GND) B14.T1(GND) B15.C2(GND) B15.T1(GND) B15.U1(GND) B15.V1(GND) B16.A1 B16.C1 B16.C2 B16.F1 B16.F2 B16.J2 B16.K1 B16.L2 B16.N1 B16.N2 B16.R1 B16.R2 B16.T1 B16.U2 B17.A1 B17.C1 B17.C2 B17.F1 B17.F2 B17.J2 B17.K1 B17.L2 B17.N1 B17.N2 B17.R1 B17.R2 B17.T1 B17.U2 B18.A1 B18.C1 B18.C2 B18.F1 B18.F2 B18.J2 B18.K1 B18.L2 B18.N1 B18.N2 B18.R1 B18.R2 B18.T1 B18.U2 B19.A1 B19.C1 B19.C2 B19.F1 B19.F2 B19.J2 B19.K1 B19.L2 B19.N1 B19.N2 B19.R1 B19.R2 B19.T1 B19.U2 B20.A1 B20.C1 B20.C2 B20.F1 B20.F2 B20.J2 B20.K1 B20.L2 B20.N1 B20.N2 B20.R1 B20.R2 B20.T1 B20.U2 C08.C2(GND) C08.T1(GND) C09.C2(GND) C09.T1(GND) C10.C2(GND) C10.T1(GND) C11.C2(GND) C11.T1(GND) C12.C2(GND) C12.T1(GND) C13.C2(GND) C13.T1(GND) C14.C2(GND) C14.T1(GND) C15.C2(GND) C15.T1(GND) C16.C2(GND) C16.T1(GND) C18.A1 C18.C1 C18.C2 C18.F1 C18.F2 C18.J2 C18.K1 C18.L2 C18.N1 C18.N2 C18.R1 C18.R2 C18.T1 C18.U2 C19.A1 C19.C1 C19.C2 C19.F1 C19.F2 C19.J2 C19.K1 C19.L2 C19.N1 C19.N2 C19.R1 C19.R2 C19.T1 C19.U2 C20.A1 C20.C1 C20.C2 C20.F1 C20.F2 C20.J2 C20.K1 C20.L2 C20.N1 C20.N2 C20.R1 C20.R2 C20.T1 C20.U2 D08.C2(GND) D08.T1(GND) D09.C2(GND) D09.T1(GND) D10.C2(GND) D10.T1(GND) D11.C2(GND) D11.T1(GND) D12.C2(GND) D12.T1(GND) D13.C2(GND) D13.T1(GND) D14.C2(GND) D14.T1(GND) D15.C2(GND) D15.T1(GND) D16.C2(GND) D16.T1(GND) D17.C2(GND) D17.T1(GND) D18.A1 D18.C1 D18.C2 D18.F1 D18.F2 D18.J2 D18.K1 D18.L2 D18.N1 D18.N2 D18.R1 D18.R2 D18.T1 D18.U2 D19.A1 D19.C1 D19.C2 D19.F1 D19.F2 D19.J2 D19.K1 D19.L2 D19.N1 D19.N2 D19.R1 D19.R2 D19.T1 D19.U2 D20.A1 D20.C1 D20.C2 D20.F1 D20.F2 D20.J2 D20.K1 D20.L2 D20.N1 D20.N2 D20.R1 D20.R2 D20.T1 D20.U2
VCC: A08.A2(VCC) A09.A2(VCC) A10.A2(VCC) A11.A2 A12.A2 A13.A2 A14.A2(VCC) A15.A2 B08.A2(VCC) B09.A2(VCC) B10.A2(VCC) B11.A2(VCC) B12.A2(VCC) B13.A2(VCC) B14.A2(VCC) B15.A2(VCC) C08.A2(VCC) C09.A2(VCC) C10.A2(VCC) C11.A2(VCC) C12.A2(VCC) C13.A2(VCC) C14.A2(VCC) C15.A2(VCC) C16.A2(VCC) D08.A2(VCC) D09.A2(VCC) D10.A2(VCC) D11.A2(VCC) D12.A2(VCC) D13.A2(VCC) D14.A2(VCC) D15.A2(VCC) D16.A2(VCC) D17.A2(VCC)

## Library data of the parts
A08 = dec-m:M117: 6 4-input NAND Gates
A09 B10 D08 = dec-m:M111: Sixteen inverters.
A10 B09 C15 D10-D14 = dec-m:M206X: Two sets of 3 D flip-flops
A11-A13 A15 = dec-m:EMPTY: Empty Slot
A14 B08 B11 B15 = dec-m:M623: 6 Dual Bus Drivers
A16-A20 B16-B20 C18-C20 D18-D20 = dec-m:M903: Two-sided Posibus cable/connector.
AB01-AB07 CD01-CD07 = dec-m:W971: Double sided Double Height Connector, 72 pins
B12-B14 C08 C14 = dec-m:M627: 6 4-input NAND Power Amplifier
C09 C16 = dec-m:M115: 8 3-input NAND Gates
C10-C13 = dec-m:M113: 10 2-input NAND Gates
C17 = dec-m:W023: One-sided 18 pin connector/cable.
D09 = dec-m:M121: 6 2-2 AND-NOR Gates
D15-D17 = dec-m:M310: Tapped Delay Line